# EAGLE design ScubaSteve (EAGLE 9.2.2)
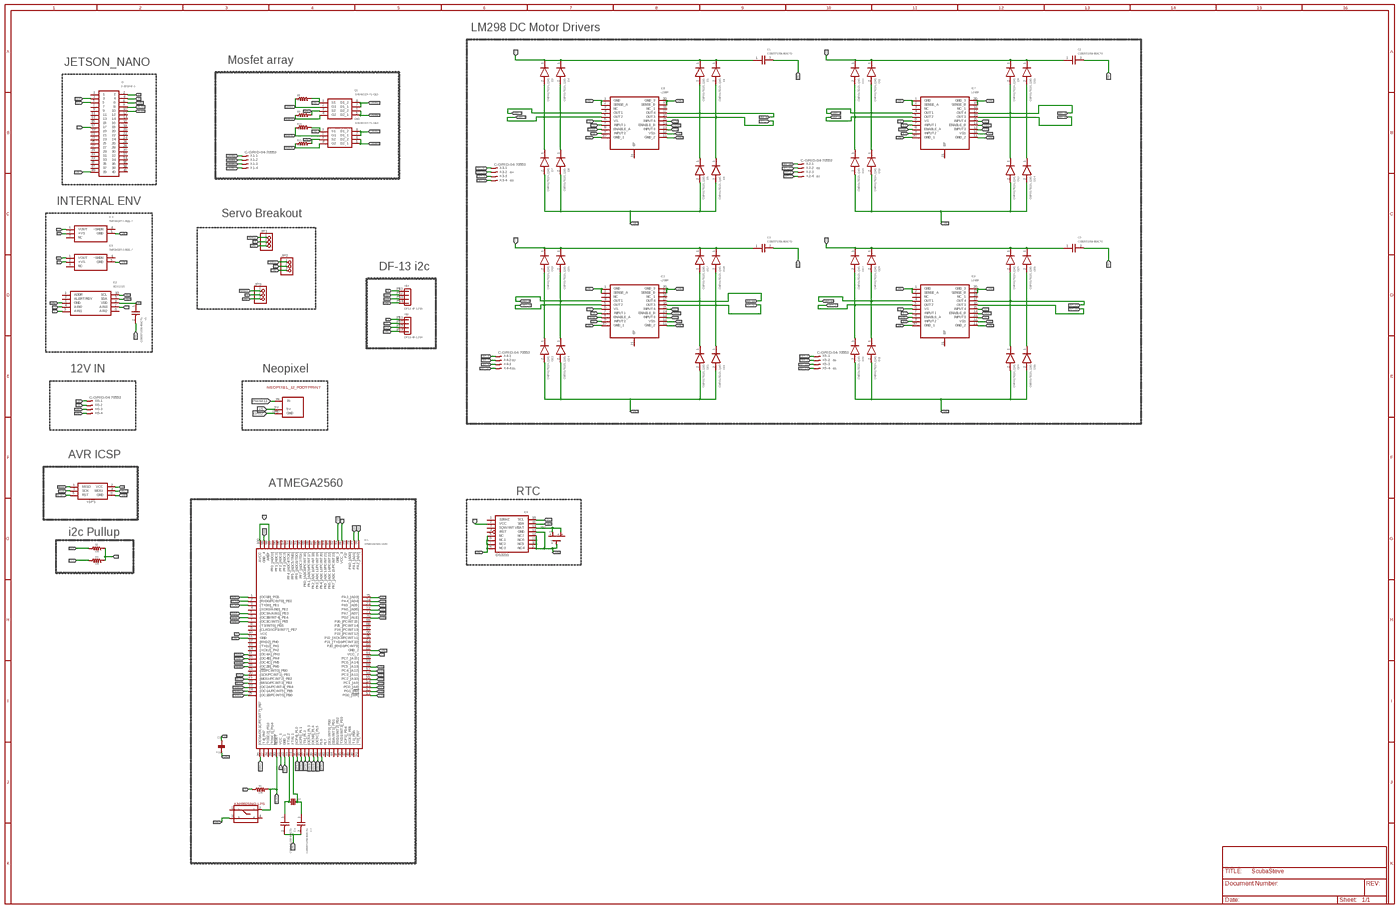
[diagram p0: schematic, sheet 1, overview]
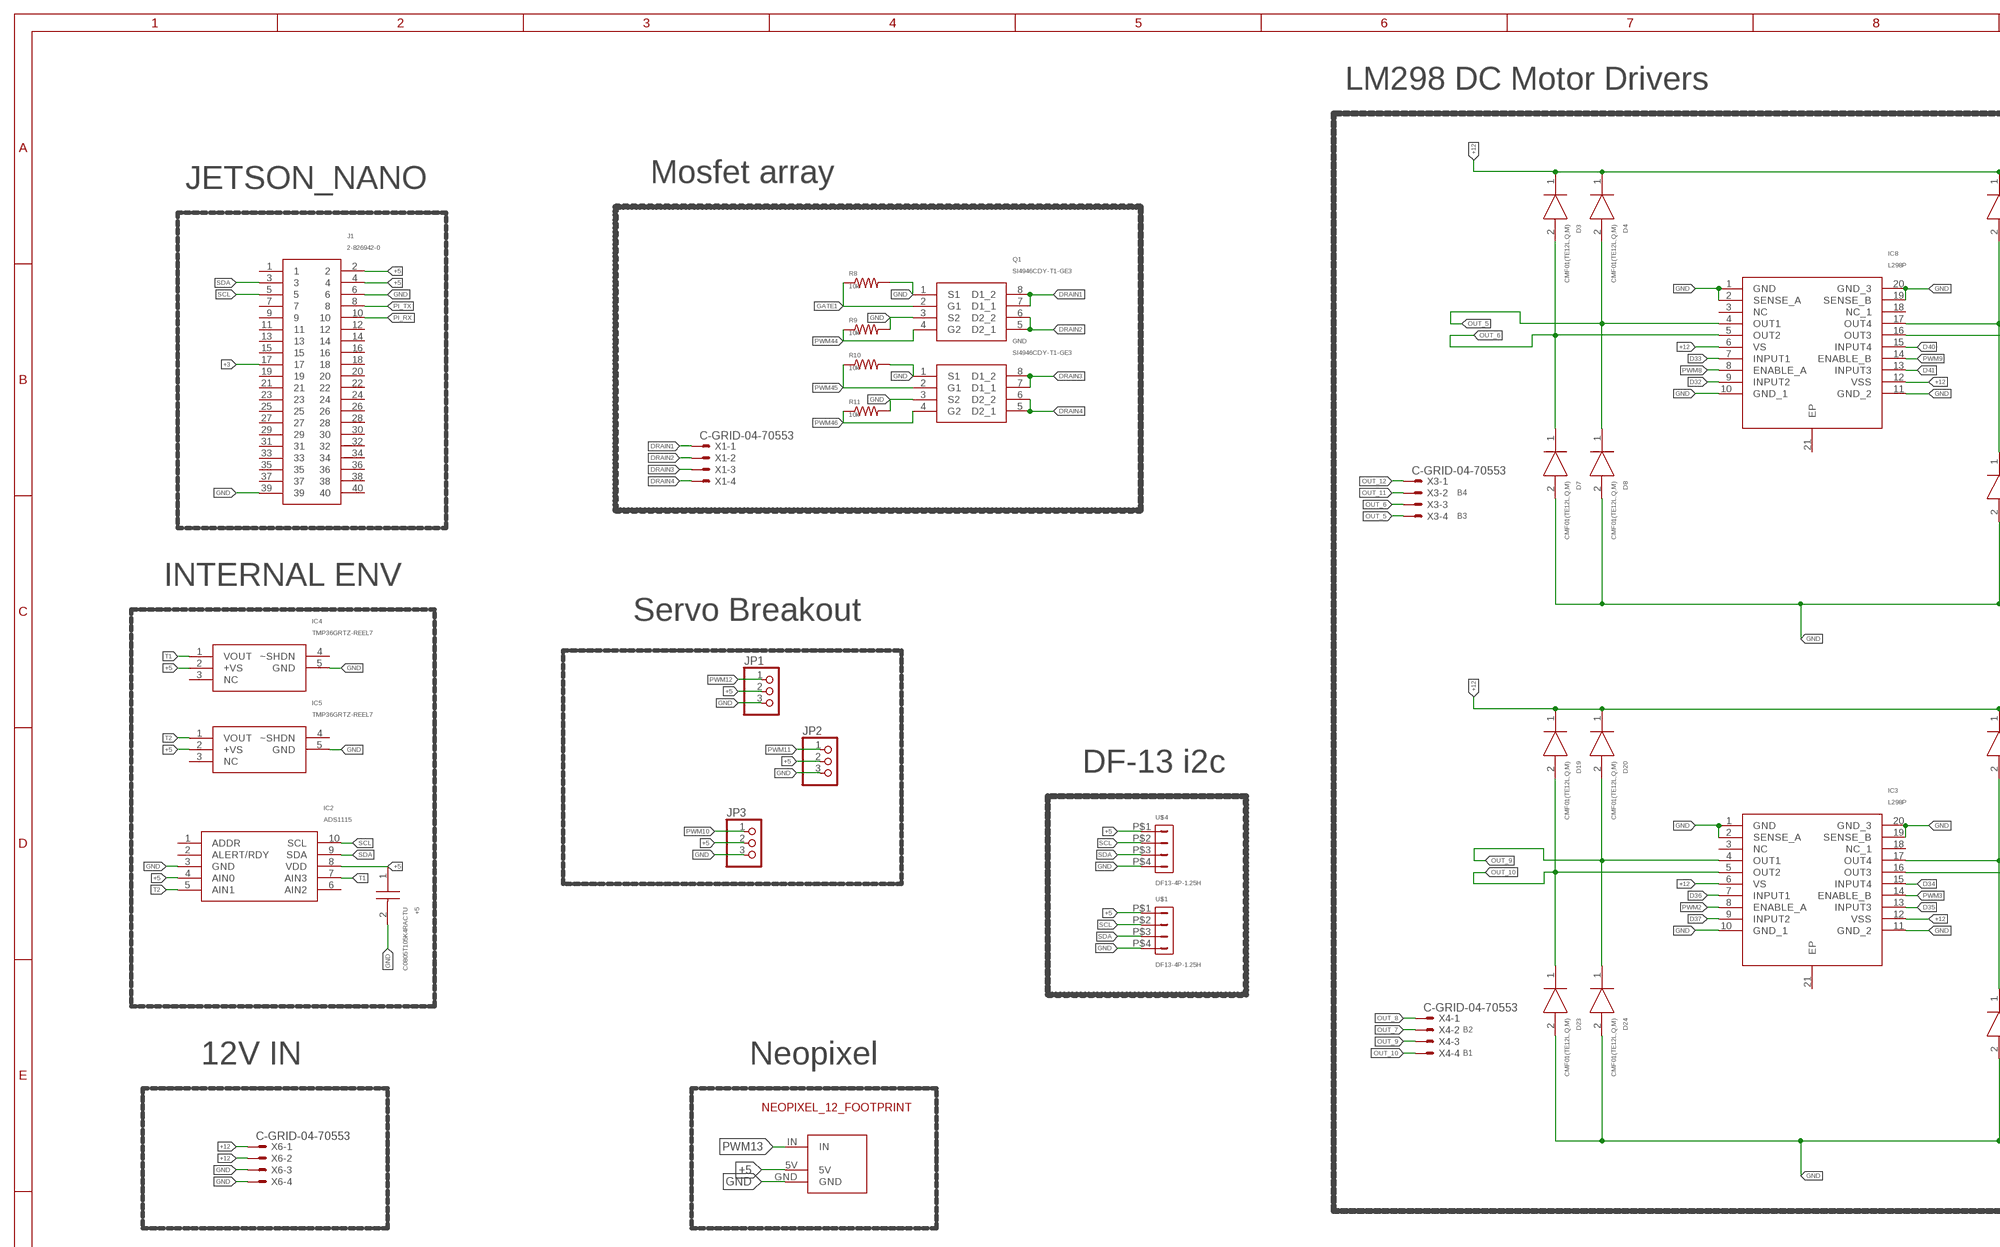
[diagram p1: schematic, sheet 1, part 1 of 4]
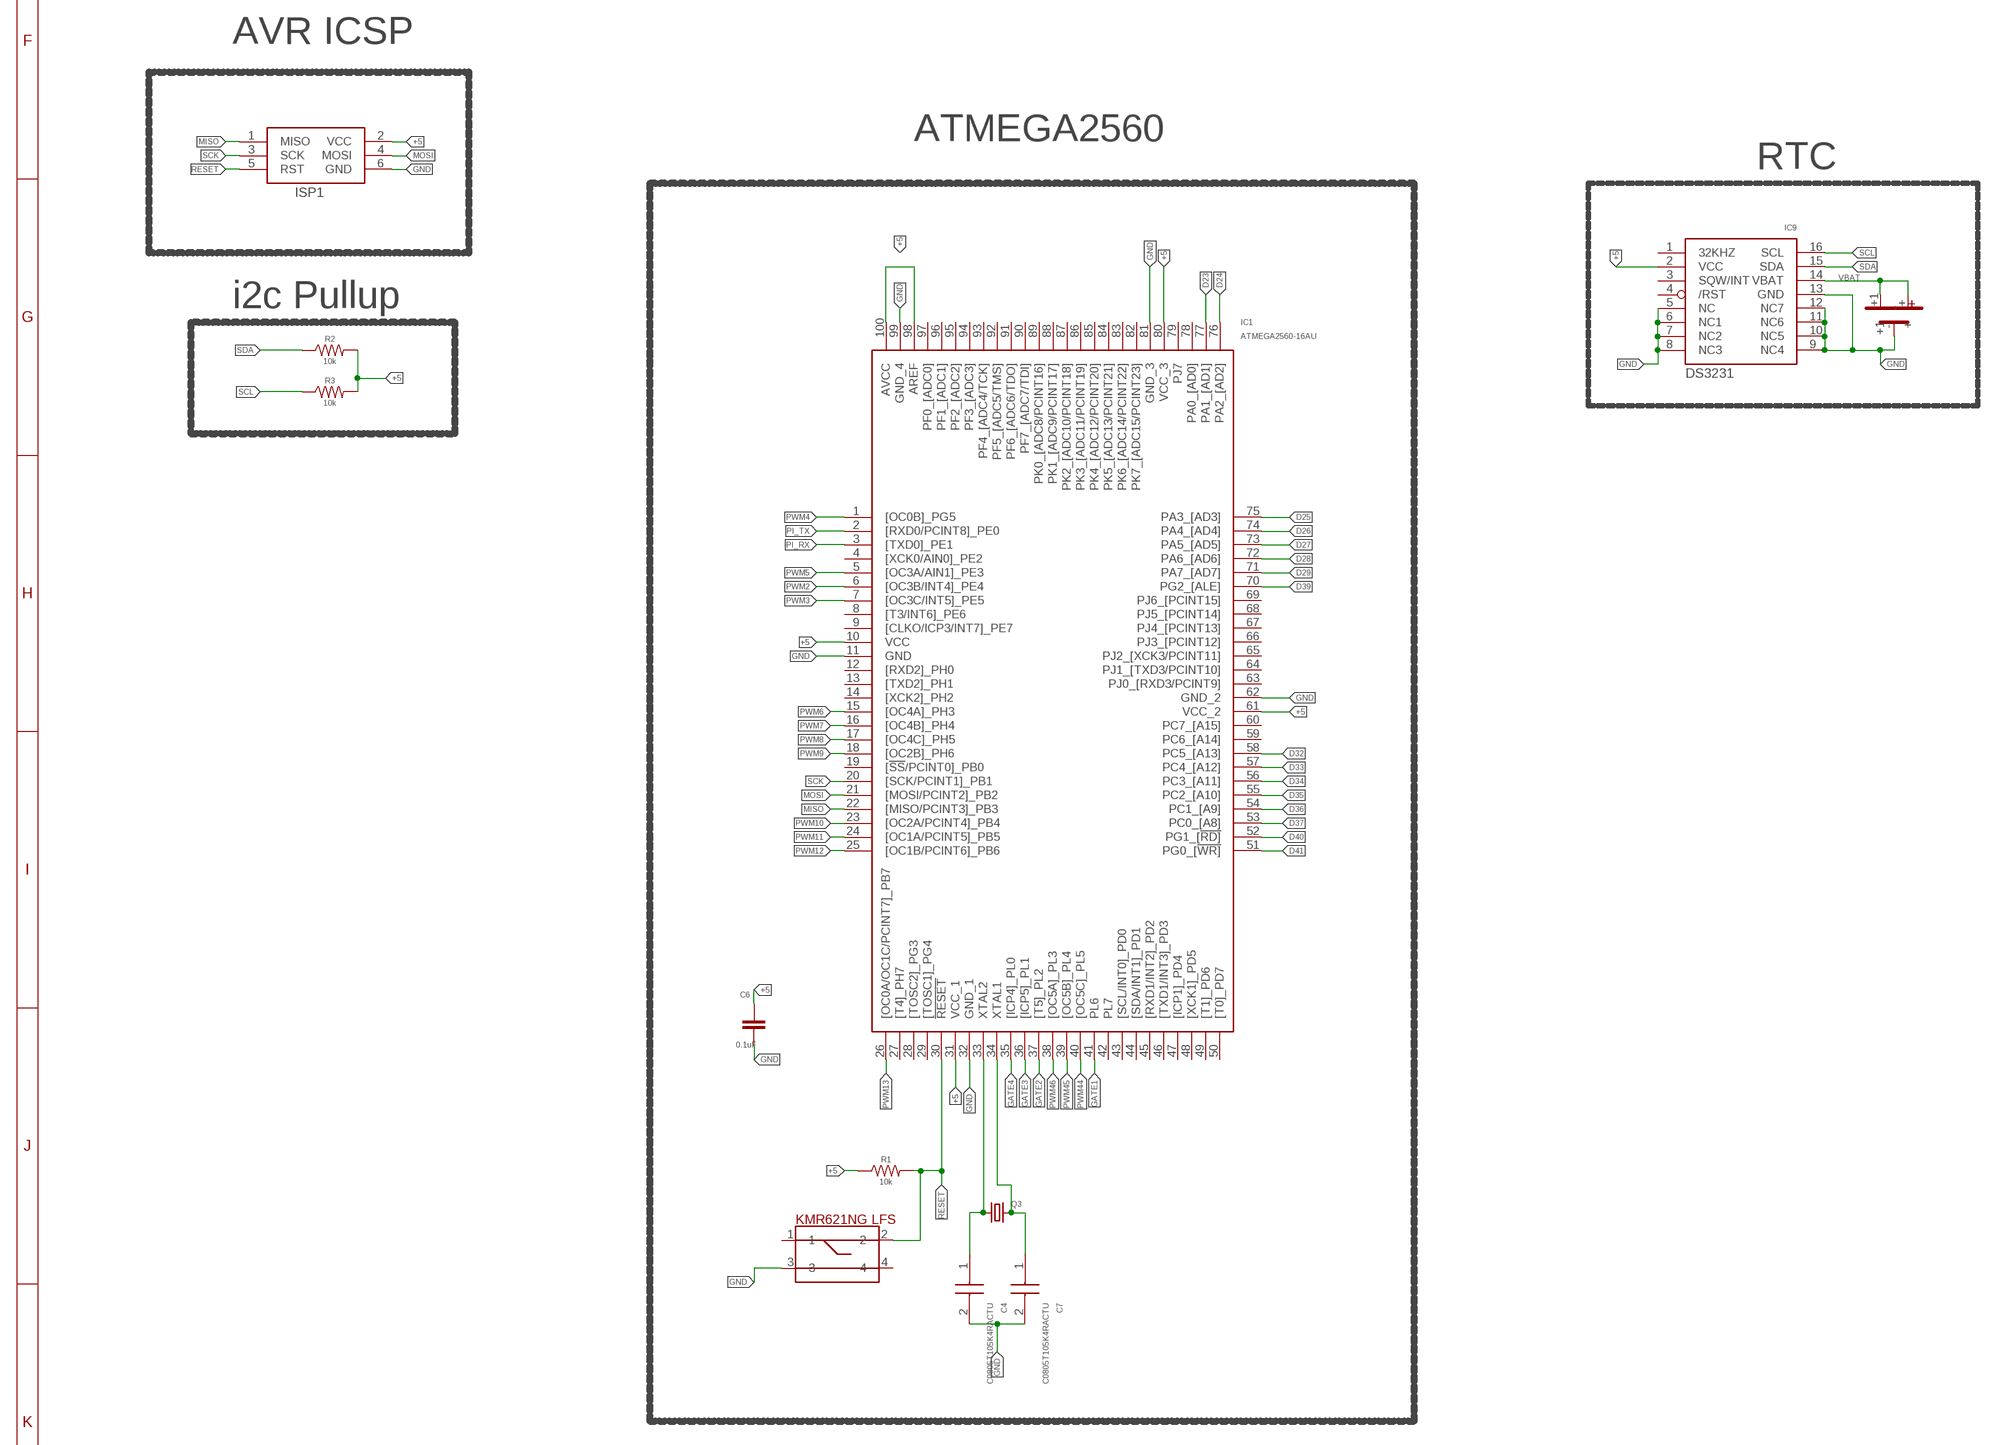
[diagram p2: schematic, sheet 1, part 2 of 4]
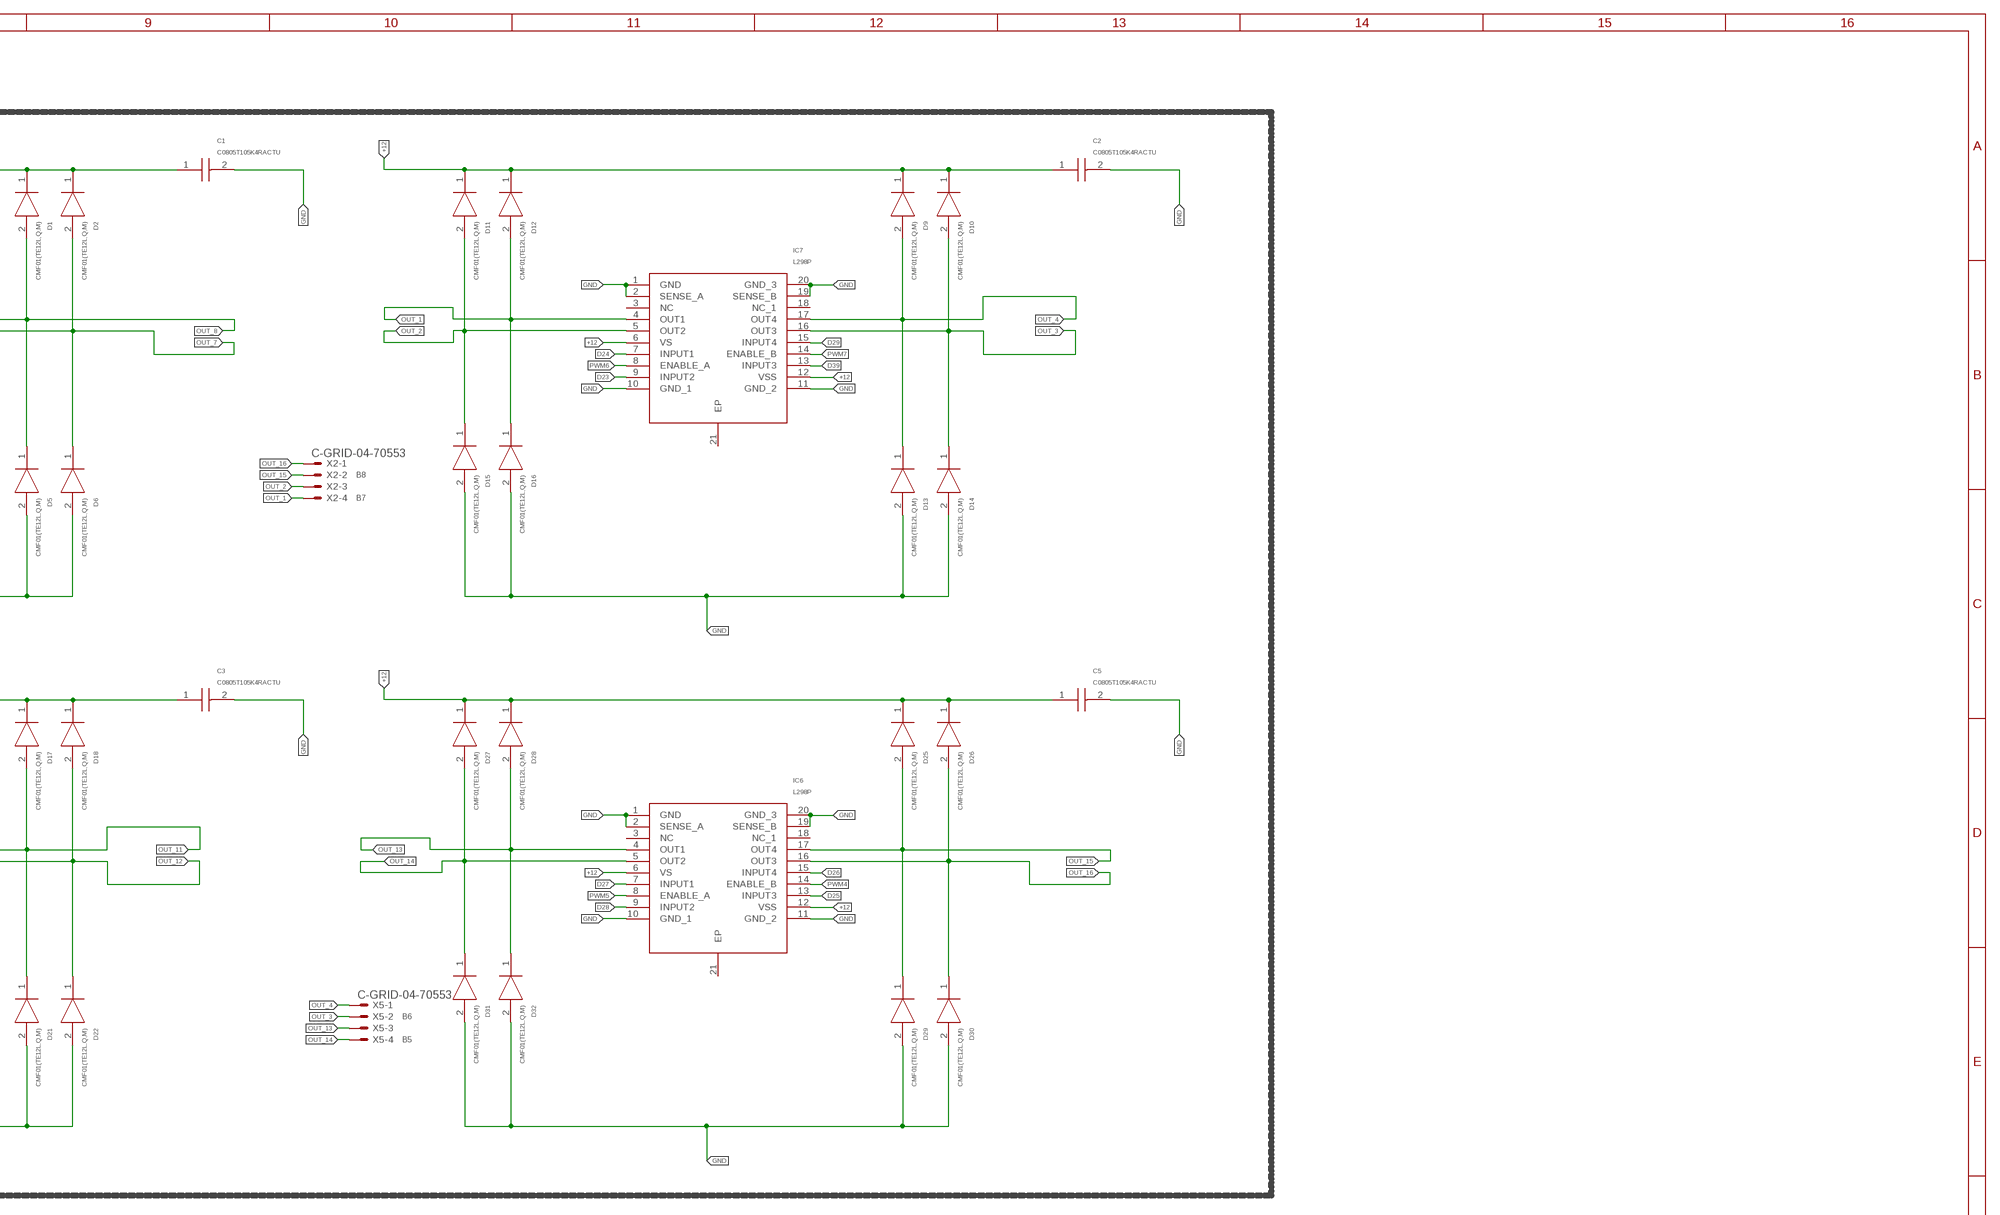
[diagram p3: schematic, sheet 1, part 3 of 4]
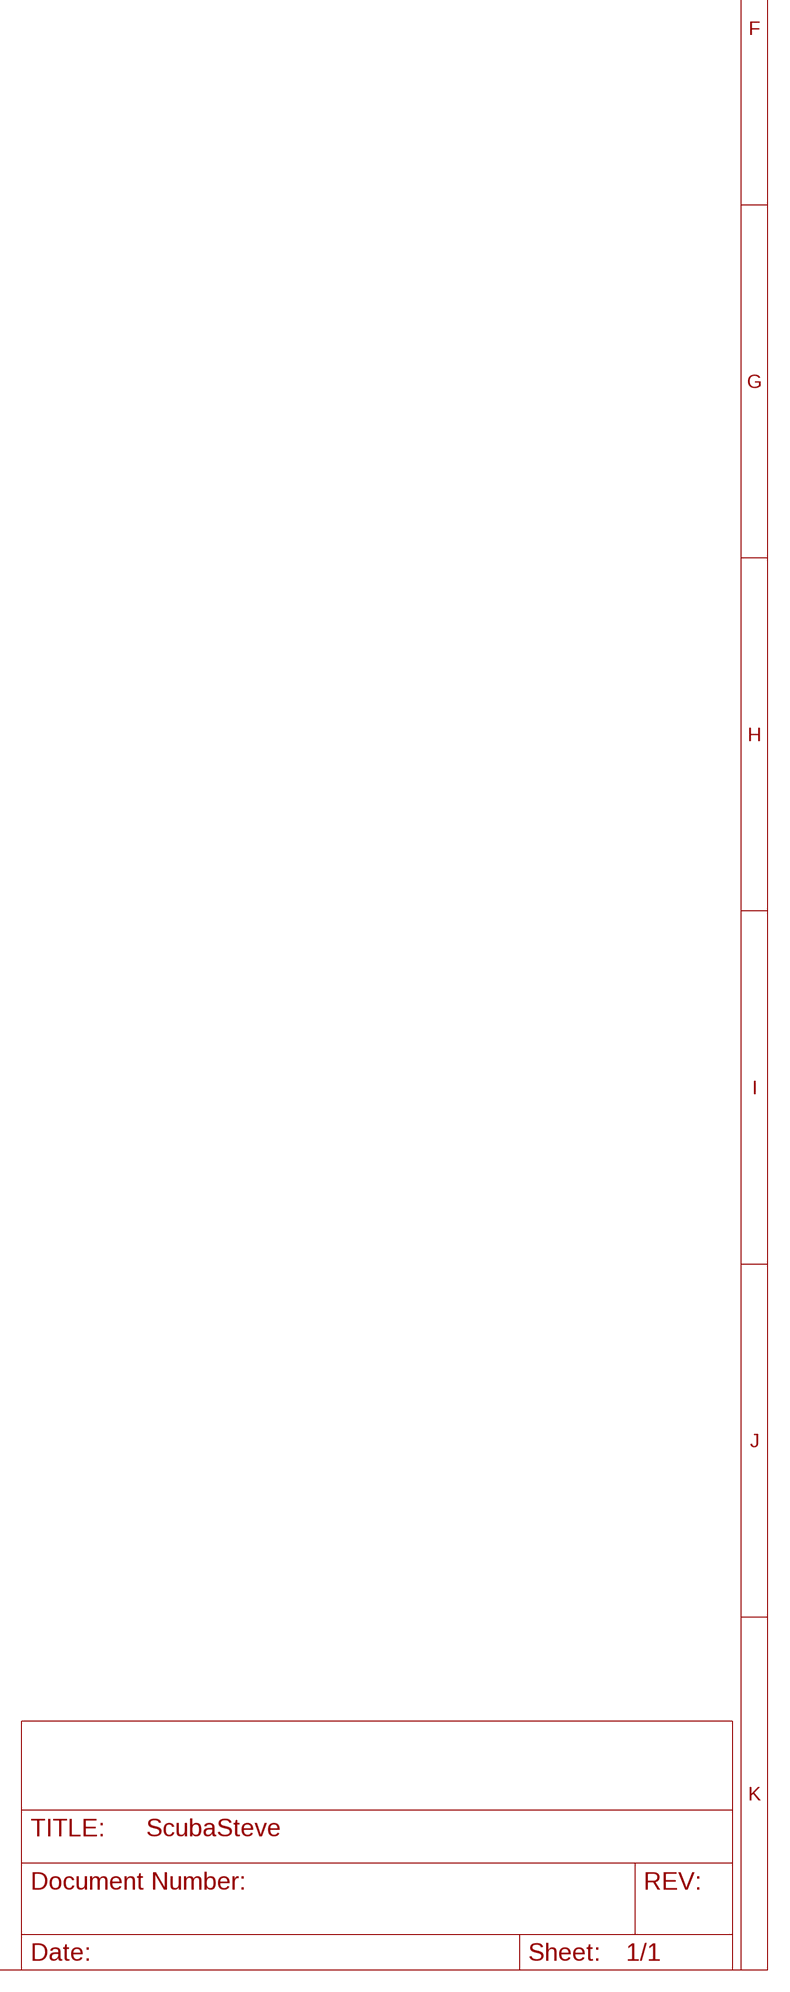
[diagram p4: schematic, sheet 1, part 4 of 4]

## Parts
+5  C0805T105K4RACTU  [CAPC2012X100N]
C1  C0805T105K4RACTU  [CAPC2012X100N]
C2  C0805T105K4RACTU  [CAPC2012X100N]
C3  C0805T105K4RACTU  [CAPC2012X100N]
C4  C0805T105K4RACTU  [CAPC2012X100N]
C5  C0805T105K4RACTU  [CAPC2012X100N]
C6  0.1uF  CC0805KRX7R9BB104  [CAP_0805]
C7  C0805T105K4RACTU  [CAPC2012X100N]
D1  CMF01(TE12L,Q,M)  [SODFL4724X108N]
D2  CMF01(TE12L,Q,M)  [SODFL4724X108N]
D3  CMF01(TE12L,Q,M)  [SODFL4724X108N]
D4  CMF01(TE12L,Q,M)  [SODFL4724X108N]
D5  CMF01(TE12L,Q,M)  [SODFL4724X108N]
D6  CMF01(TE12L,Q,M)  [SODFL4724X108N]
D7  CMF01(TE12L,Q,M)  [SODFL4724X108N]
D8  CMF01(TE12L,Q,M)  [SODFL4724X108N]
D9  CMF01(TE12L,Q,M)  [SODFL4724X108N]
D10  CMF01(TE12L,Q,M)  [SODFL4724X108N]
D11  CMF01(TE12L,Q,M)  [SODFL4724X108N]
D12  CMF01(TE12L,Q,M)  [SODFL4724X108N]
D13  CMF01(TE12L,Q,M)  [SODFL4724X108N]
D14  CMF01(TE12L,Q,M)  [SODFL4724X108N]
D15  CMF01(TE12L,Q,M)  [SODFL4724X108N]
D16  CMF01(TE12L,Q,M)  [SODFL4724X108N]
D17  CMF01(TE12L,Q,M)  [SODFL4724X108N]
D18  CMF01(TE12L,Q,M)  [SODFL4724X108N]
D19  CMF01(TE12L,Q,M)  [SODFL4724X108N]
D20  CMF01(TE12L,Q,M)  [SODFL4724X108N]
D21  CMF01(TE12L,Q,M)  [SODFL4724X108N]
D22  CMF01(TE12L,Q,M)  [SODFL4724X108N]
D23  CMF01(TE12L,Q,M)  [SODFL4724X108N]
D24  CMF01(TE12L,Q,M)  [SODFL4724X108N]
D25  CMF01(TE12L,Q,M)  [SODFL4724X108N]
D26  CMF01(TE12L,Q,M)  [SODFL4724X108N]
D27  CMF01(TE12L,Q,M)  [SODFL4724X108N]
D28  CMF01(TE12L,Q,M)  [SODFL4724X108N]
D29  CMF01(TE12L,Q,M)  [SODFL4724X108N]
D30  CMF01(TE12L,Q,M)  [SODFL4724X108N]
D31  CMF01(TE12L,Q,M)  [SODFL4724X108N]
D32  CMF01(TE12L,Q,M)  [SODFL4724X108N]
GND  SI4946CDY-T1-GE3  [SOIC127P600X175-8N]
IC1  ATMEGA2560-16AU  [QFP50P1600X1600X120-100N]
IC2  ADS1115  ADS1115IDGST  [SOP50P490X110-10N]
IC3  L298P  [SOIC127P1420X360-21N]
IC4  TMP36GRTZ-REEL7  [SOT95P280X145-5N]
IC5  TMP36GRTZ-REEL7  [SOT95P280X145-5N]
IC6  L298P  [SOIC127P1420X360-21N]
IC7  L298P  [SOIC127P1420X360-21N]
IC8  L298P  [SOIC127P1420X360-21N]
IC9  DS3231/SO  [SO16W]
ISP1  AVRISP-6  [AVRISP]
J1  2-826942-0  [HDRV40W63P254_2X20_5080X500X88]
JP1  PINHD-1X3  [1X03]
JP2  PINHD-1X3  [1X03]
JP3  PINHD-1X3  [1X03]
Q1  SI4946CDY-T1-GE3  [SOIC127P600X175-8N]
Q3  CRYSTALHC49S  [HC49/S]
R1  10k  10KOHM-0603-1/10W-1%  [0603]
R2  10k  10KOHM-0603-1/10W-1%  [0603]
R3  10k  10KOHM-0603-1/10W-1%  [0603]
R8  10k  10KOHM-0603-1/10W-1%  [0603]
R9  10k  10KOHM-0603-1/10W-1%  [0603]
R10  10k  10KOHM-0603-1/10W-1%  [0603]
R11  10k  10KOHM-0603-1/10W-1%  [0603]
U$1  DF13-4P-1.25H  [DF13A-4P-1.25H]
U$3  NEOPIXEL_12_FOOTPRINT  [NEOPIXEL_12_FOOTPRINT]
U$4  DF13-4P-1.25H  [DF13A-4P-1.25H]
U$11  CR1220_HOLDER  [CR1220_HOLDER]
U$12  KMR621NGLFS  [KMR621NGLFS]
X1  C-GRID-04-70553  [70553-04]
X2  C-GRID-04-70553  [70553-04]
X3  C-GRID-04-70553  [70553-04]
X4  C-GRID-04-70553  [70553-04]
X5  C-GRID-04-70553  [70553-04]
X6  C-GRID-04-70553  [70553-04]

## Nets
+3: J1.17
+5: +5.1 C6.1 IC1.10(VCC) IC1.31(VCC_1) IC1.61(VCC_2) IC1.80(VCC_3) IC1.98(AREF) IC1.100(AVCC) IC2.4(AIN0) IC2.8(VDD) IC4.2(+VS) IC5.2(+VS) IC9.2(VCC) ISP1.2(VCC) J1.2 J1.4 JP1.2 JP2.2 JP3.2 R1.1 R2.2 R3.2 U$1.P$1 U$3.5V U$4.P$1
+12: C1.1 C2.1 C3.1 C5.1 D1.1(K) D2.1(K) D3.1(K) D4.1(K) D9.1(K) D10.1(K) D11.1(K) D12.1(K) D17.1(K) D18.1(K) D19.1(K) D20.1(K) D25.1(K) D26.1(K) D27.1(K) D28.1(K) IC3.6(VS) IC3.12(VSS) IC6.6(VS) IC6.12(VSS) IC7.6(VS) IC7.12(VSS) IC8.6(VS) IC8.12(VSS) X6.1 X6.2
D23: IC1.77(PA1_[AD1]) IC7.9(INPUT2)
D24: IC1.76(PA2_[AD2]) IC7.7(INPUT1)
D25: IC1.75(PA3_[AD3]) IC6.13(INPUT3)
D26: IC1.74(PA4_[AD4]) IC6.15(INPUT4)
D27: IC1.73(PA5_[AD5]) IC6.7(INPUT1)
D28: IC1.72(PA6_[AD6]) IC6.9(INPUT2)
D29: IC1.71(PA7_[AD7]) IC7.15(INPUT4)
D32: IC1.58(PC5_[A13]) IC8.9(INPUT2)
D33: IC1.57(PC4_[A12]) IC8.7(INPUT1)
D34: IC1.56(PC3_[A11]) IC3.15(INPUT4)
D35: IC1.55(PC2_[A10]) IC3.13(INPUT3)
D36: IC1.54(PC1_[A9]) IC3.7(INPUT1)
D37: IC1.53(PC0_[A8]) IC3.9(INPUT2)
D39: IC1.70(PG2_[ALE]) IC7.13(INPUT3)
D40: IC1.52(PG1_[!RD]) IC8.15(INPUT4)
D41: IC1.51(PG0_[!WR]) IC8.13(INPUT3)
DRAIN1: Q1.7(D1_1) Q1.8(D1_2) X1.1
DRAIN2: Q1.5(D2_1) Q1.6(D2_2) X1.2
DRAIN3: GND.7(D1_1) GND.8(D1_2) X1.3
DRAIN4: GND.5(D2_1) GND.6(D2_2) X1.4
GATE1: IC1.41(PL6) Q1.2(G1) R8.1
GATE2: IC1.37([T5]_PL2)
GATE3: IC1.36([ICP5]_PL1)
GATE4: IC1.35([ICP4]_PL0)
GND: +5.2 C1.2 C2.2 C3.2 C4.2 C5.2 C6.2 C7.2 D5.2(A) D6.2(A) D7.2(A) D8.2(A) D13.2(A) D14.2(A) D15.2(A) D16.2(A) D21.2(A) D22.2(A) D23.2(A) D24.2(A) D29.2(A) D30.2(A) D31.2(A) D32.2(A) GND.1(S1) GND.3(S2) IC1.11(GND) IC1.32(GND_1) IC1.62(GND_2) IC1.81(GND_3) IC1.99(GND_4) IC2.3(GND) IC3.1(GND) IC3.2(SENSE_A) IC3.10(GND_1) IC3.11(GND_2) IC3.19(SENSE_B) IC3.20(GND_3) IC4.5(GND) IC5.5(GND) IC6.1(GND) IC6.2(SENSE_A) IC6.10(GND_1) IC6.11(GND_2) IC6.19(SENSE_B) IC6.20(GND_3) IC7.1(GND) IC7.2(SENSE_A) IC7.10(GND_1) IC7.11(GND_2) IC7.19(SENSE_B) IC7.20(GND_3) IC8.1(GND) IC8.2(SENSE_A) IC8.10(GND_1) IC8.11(GND_2) IC8.19(SENSE_B) IC8.20(GND_3) IC9.5(NC) IC9.6(NC1) IC9.7(NC2) IC9.8(NC3) IC9.9(NC4) IC9.10(NC5) IC9.11(NC6) IC9.12(NC7) IC9.13(GND) ISP1.6(GND) J1.6 J1.39 JP1.3 JP2.3 JP3.3 Q1.1(S1) Q1.3(S2) R8.2 R9.2 R10.2 R11.2 U$1.P$4 U$3.GND U$4.P$4 U$11.- U$12.3 X6.3 X6.4
MISO: IC1.22([MISO/PCINT3]_PB3) ISP1.1(MISO)
MOSI: IC1.21([MOSI/PCINT2]_PB2) ISP1.4(MOSI)
N$1: C4.1 IC1.33(XTAL2) Q3.1
N$2: C7.1 IC1.34(XTAL1) Q3.2
OUT_1: D12.2(A) D16.1(K) IC7.4(OUT1) X2.4
OUT_2: D11.2(A) D15.1(K) IC7.5(OUT2) X2.3
OUT_3: D10.2(A) D14.1(K) IC7.16(OUT3) X5.2
OUT_4: D9.2(A) D13.1(K) IC7.17(OUT4) X5.1
OUT_5: D4.2(A) D8.1(K) IC8.4(OUT1) X3.4
OUT_6: D3.2(A) D7.1(K) IC8.5(OUT2) X3.3
OUT_7: D2.2(A) D6.1(K) IC8.16(OUT3) X4.2
OUT_8: D1.2(A) D5.1(K) IC8.17(OUT4) X4.1
OUT_9: D20.2(A) D24.1(K) IC3.4(OUT1) X4.3
OUT_10: D19.2(A) D23.1(K) IC3.5(OUT2) X4.4
OUT_11: D17.2(A) D21.1(K) IC3.17(OUT4) X3.2
OUT_12: D18.2(A) D22.1(K) IC3.16(OUT3) X3.1
OUT_13: D28.2(A) D32.1(K) IC6.4(OUT1) X5.3
OUT_14: D27.2(A) D31.1(K) IC6.5(OUT2) X5.4
OUT_15: D25.2(A) D29.1(K) IC6.17(OUT4) X2.2
OUT_16: D26.2(A) D30.1(K) IC6.16(OUT3) X2.1
PI_RX: IC1.3([TXD0]_PE1) J1.10
PI_TX: IC1.2([RXD0/PCINT8]_PE0) J1.8
PWM2: IC1.6([OC3B/INT4]_PE4) IC3.8(ENABLE_A)
PWM3: IC1.7([OC3C/INT5]_PE5) IC3.14(ENABLE_B)
PWM4: IC1.1([OC0B]_PG5) IC6.14(ENABLE_B)
PWM5: IC1.5([OC3A/AIN1]_PE3) IC6.8(ENABLE_A)
PWM6: IC1.15([OC4A]_PH3) IC7.8(ENABLE_A)
PWM7: IC1.16([OC4B]_PH4) IC7.14(ENABLE_B)
PWM8: IC1.17([OC4C]_PH5) IC8.8(ENABLE_A)
PWM9: IC1.18([OC2B]_PH6) IC8.14(ENABLE_B)
PWM10: IC1.23([OC2A/PCINT4]_PB4) JP3.1
PWM11: IC1.24([OC1A/PCINT5]_PB5) JP2.1
PWM12: IC1.25([OC1B/PCINT6]_PB6) JP1.1
PWM13: IC1.26([OC0A/OC1C/PCINT7]_PB7) U$3.IN
PWM44: IC1.40([OC5C]_PL5) Q1.4(G2) R9.1
PWM45: GND.2(G1) IC1.39([OC5B]_PL4) R10.1
PWM46: GND.4(G2) IC1.38([OC5A]_PL3) R11.1
RESET: IC1.30(!RESET) ISP1.5(RST) R1.2 U$12.2
SCK: IC1.20([SCK/PCINT1]_PB1) ISP1.3(SCK)
SCL: IC2.10(SCL) IC9.16(SCL) J1.5 R3.1 U$1.P$2 U$4.P$2
SDA: IC2.9(SDA) IC9.15(SDA) J1.3 R2.1 U$1.P$3 U$4.P$3
T1: IC2.7(AIN3) IC4.1(VOUT)
T2: IC2.5(AIN1) IC5.1(VOUT)
VBAT: IC9.14(VBAT) U$11.+ U$11.+1
Unconnected: IC1.4([XCK0/AIN0]_PE2) IC1.8([T3/INT6]_PE6) IC1.9([CLKO/ICP3/INT7]_PE7) IC1.12([RXD2]_PH0) IC1.13([TXD2]_PH1) IC1.14([XCK2]_PH2) IC1.19([!SS!/PCINT0]_PB0) IC1.27([T4]_PH7) IC1.28([TOSC2]_PG3) IC1.29([TOSC1]_PG4) IC1.42(PL7) IC1.43([SCL/INT0]_PD0) IC1.44([SDA/INT1]_PD1) IC1.45([RXD1/INT2]_PD2) IC1.46([TXD1/INT3]_PD3) IC1.47([ICP1]_PD4) IC1.48([XCK1]_PD5) IC1.49([T1]_PD6) IC1.50([T0]_PD7) IC1.59(PC6_[A14]) IC1.60(PC7_[A15]) IC1.63(PJ0_[RXD3/PCINT9]) IC1.64(PJ1_[TXD3/PCINT10]) IC1.65(PJ2_[XCK3/PCINT11]) IC1.66(PJ3_[PCINT12]) IC1.67(PJ4_[PCINT13]) IC1.68(PJ5_[PCINT14]) IC1.69(PJ6_[PCINT15]) IC1.78(PA0_[AD0]) IC1.79(PJ7) IC1.82(PK7_[ADC15/PCINT23]) IC1.83(PK6_[ADC14/PCINT22]) IC1.84(PK5_[ADC13/PCINT21]) IC1.85(PK4_[ADC12/PCINT20]) IC1.86(PK3_[ADC11/PCINT19]) IC1.87(PK2_[ADC10/PCINT18]) IC1.88(PK1_[ADC9/PCINT17]) IC1.89(PK0_[ADC8/PCINT16]) IC1.90(PF7_[ADC7/TDI]) IC1.91(PF6_[ADC6/TDO]) IC1.92(PF5_[ADC5/TMS]) IC1.93(PF4_[ADC4/TCK]) IC1.94(PF3_[ADC3]) IC1.95(PF2_[ADC2]) IC1.96(PF1_[ADC1]) IC1.97(PF0_[ADC0]) IC2.1(ADDR) IC2.2(ALERT/RDY) IC2.6(AIN2) IC3.3(NC) IC3.18(NC_1) IC3.21(EP) IC4.3(NC) IC4.4(~SHDN) IC5.3(NC) IC5.4(~SHDN) IC6.3(NC) IC6.18(NC_1) IC6.21(EP) IC7.3(NC) IC7.18(NC_1) IC7.21(EP) IC8.3(NC) IC8.18(NC_1) IC8.21(EP) IC9.1(32KHZ) IC9.3(SQW/INT) IC9.4(/RST) J1.1 J1.7 J1.9 J1.11 J1.12 J1.13 J1.14 J1.15 J1.16 J1.18 J1.19 J1.20 J1.21 J1.22 J1.23 J1.24 J1.25 J1.26 J1.27 J1.28 J1.29 J1.30 J1.31 J1.32 J1.33 J1.34 J1.35 J1.36 J1.37 J1.38 J1.40 U$12.1 U$12.4

## Notes on the sheet
- LM298 DC Motor Drivers
- JETSON_NANO | Mosfet array
- B8
- B4
- B7
- B3
- INTERNAL ENV
- Servo Breakout
- DF-13 i2c
- B2 | B6
- B1 | B5
- 12V IN | Neopixel
- AVR ICSP
- ATMEGA2560
- RTC
- i2c Pullup

## Library data of the parts
+5 C1-C5 C7 = SamacSys_Parts:C0805T105K4RACTU: KEMET - C0805T105K4RACTU - CAP, 1F, 16V, 10%, X7R, 0805 Source: Datasheet <https://componentsearchengine.com/Datasheets/1/C0805T105K4RACTU.pdf>; DESCRIPTION: KEMET - C0805T105K4RACTU - CAP, 1F, 16V, 10%, X7R, 0805; HEIGHT: 1mm; MANUFACTURER_NAME: Kemet; MANUFACTURER_PART_NUMBER: C0805T105K4RACTU; MOUSER_PART_NUMBER: 80-C0805T105K4RACTU
C6 = Resistor_Capacitor:CC0805KRX7R9BB104: CAP CER 0.1UF 50V X7R 0805 Manufacturer's datasheet <http://www.yageo.com/documents/recent/UPY-GPHC_X7R_6.3V-to-50V_18.pdf>; CREATED_BY: PCBLayout.com; DIGIKEY_PART_NUMBER: 311-1140-2-ND; MANUFACTURER: Yageo; MPN: CC0805KRX7R9BB104; PACKAGE: SMD 0805
D1-D32 = SamacSys_Parts:CMF01(TE12L,Q,M): Diodes - General Purpose, Power, Switching 600V 2A M-FLAT Source: Datasheet <https://componentsearchengine.com/Datasheets/1/CMF01(TE12L,Q,M).pdf>; DESCRIPTION: Diodes - General Purpose, Power, Switching 600V 2A M-FLAT; HEIGHT: 1.08mm; MANUFACTURER_NAME: Toshiba; MANUFACTURER_PART_NUMBER: CMF01(TE12L,Q,M); MOUSER_PART_NUMBER: 757-CMF01TE12LQM
GND Q1 = SamacSys_Parts:SI4946CDY-T1-GE3: VISHAY - SI4946CDY-T1-GE3 - MOSFET, DUAL N-CH, 60V, SOIC Source: Datasheet <https://componentsearchengine.com/Datasheets/1/SI4946CDY-T1-GE3.pdf>; DESCRIPTION: VISHAY - SI4946CDY-T1-GE3 - MOSFET, DUAL N-CH, 60V, SOIC; HEIGHT: 1.75mm; MANUFACTURER_NAME: Vishay; MANUFACTURER_PART_NUMBER: SI4946CDY-T1-GE3; MOUSER_PART_NUMBER: 78-SI4946CDY-T1-GE3
IC1 = SamacSys_Parts:ATMEGA2560-16AU: ATMEGA2560-16AU, 8 bit AVR Microcontroller 16MHz 4, 256kb Flash, 8kb RAM, I2C SPI 100-Pin TQFP Source: Datasheet <https://componentsearchengine.com/Datasheets/1/ATMEGA2560-16AU.pdf>; DESCRIPTION: ATMEGA2560-16AU, 8 bit AVR Microcontroller 16MHz 4, 256kb Flash, 8kb RAM, I2C SPI 100-Pin TQFP; HEIGHT: 1.2mm; MANUFACTURER_NAME: Microchip; MANUFACTURER_PART_NUMBER: ATMEGA2560-16AU; MOUSER_PART_NUMBER: 556-ATMEGA2560-16AU
IC2 = SamacSys_Parts:ADS1115IDGST: 16-Bit, 860SPS, 4-Ch Delta-Sigma ADC w/ PGA, Oscillator, Voltage Reference, Comparator & I2C Source: Datasheet; DESCRIPTION: 16-Bit, 860SPS, 4-Ch Delta-Sigma ADC w/ PGA, Oscillator, Voltage Reference, Comparator & I2C; HEIGHT: 1.1mm; MANUFACTURER_NAME: Texas Instruments; MANUFACTURER_PART_NUMBER: ADS1115IDGST; MOUSER_PART_NUMBER: 595-ADS1115IDGST
IC3 IC6-IC8 = SamacSys_Parts:L298P: L298P, Full Bridge Motor Driver, 3A Dual Full Bridge Motor Driver,, 25W 4.8 46 V, 20-Pin Power SO Source: Datasheet <http://www.mouser.com/datasheet/2/389/l298-954744.pdf>; DESCRIPTION: L298P, Full Bridge Motor Driver, 3A Dual Full Bridge Motor Driver,, 25W 4.8 46 V, 20-Pin Power SO; HEIGHT: 3.6mm; MANUFACTURER_NAME: STMicroelectronics; MANUFACTURER_PART_NUMBER: L298P; MOUSER_PART_NUMBER: 511-L298P
IC4 IC5 = SamacSys_Parts:TMP36GRTZ-REEL7: Analog Devices TMP36GRTZ-REEL7 Temperature Sensor 5-Pin SOT-23, -40 +125 C Source: Datasheet <https://componentsearchengine.com/Datasheets/1/TMP36GRTZ-REEL7.pdf>; DESCRIPTION: Analog Devices TMP36GRTZ-REEL7 Temperature Sensor 5-Pin SOT-23, -40 +125 C; HEIGHT: mm; MANUFACTURER_NAME: Analog Devices; MANUFACTURER_PART_NUMBER: TMP36GRTZ-REEL7; MOUSER_PART_NUMBER: 584-TMP36GRTZ-R7
IC9 = adafruit:DS3231
ISP1 = adafruit:AVRISP: AVR ISP HEADER Standard 6 pin header for AVR programming
J1 = SamacSys_Parts:2-826942-0: 2x20 straight pin header tin Mod II Source: Datasheet <https://componentsearchengine.com/Datasheets/1/2-826942-0.pdf>; DESCRIPTION: 2x20 straight pin header tin Mod II; HEIGHT: 8.8mm; MANUFACTURER_NAME: TE Connectivity; MANUFACTURER_PART_NUMBER: 2-826942-0; MOUSER_PART_NUMBER: 571-2-826942-0
JP1-JP3 = adafruit:PINHD-1X3: PIN HEADER
Q3 = adafruit:CRYSTAL: CRYSTAL; OC_FARNELL: 1667008; OC_NEWARK: unknown
R1-R3 R8-R11 = SparkFun-Resistors:10KOHM: 10kΩ resistor A resistor is a passive two-terminal electrical component that implements electrical resistance as a circuit element. Resistors act to reduce current flow, and, at the same time, act to lower voltage levels within circuits. - Wikipedia; PROD_ID: RES-00824
U$1 U$4 = con-hirose-df13:DF13-4P-1.25: DF13-4P 1.25mm Pitch Miniature Crimping Connector.
U$3 = NEOPIXEL_12_FOOTPRINT:NEOPIXEL_12_FOOTPRINT
U$11 = CR1220_HOLDER:CR1220_HOLDER
U$12 = KMR621NG LFS:KMR621NGLFS
X1-X6 = con-molex:C-GRID-04: CONNECTOR wire to board 2.54 mm (0.100") pitch header; MF: MOLEX; OC_FARNELL: unknown; OC_NEWARK: unknown

## Board
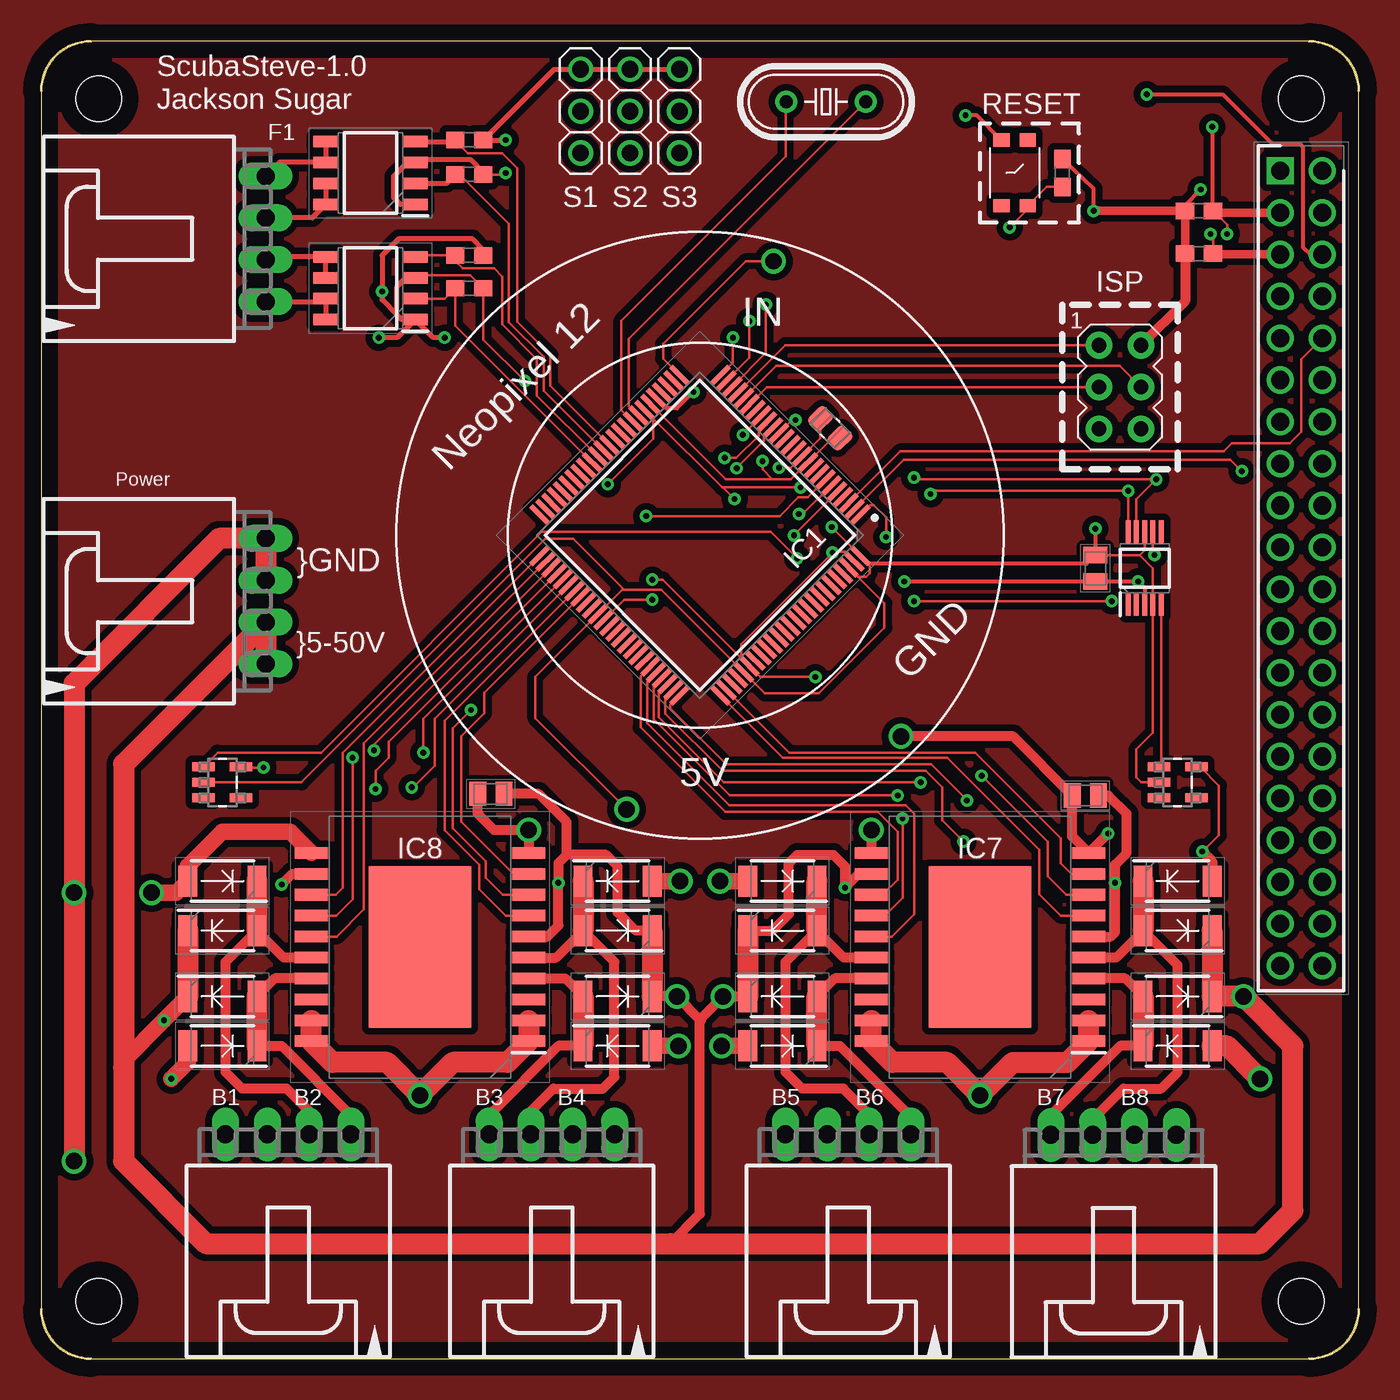
[diagram p5: board, top side]
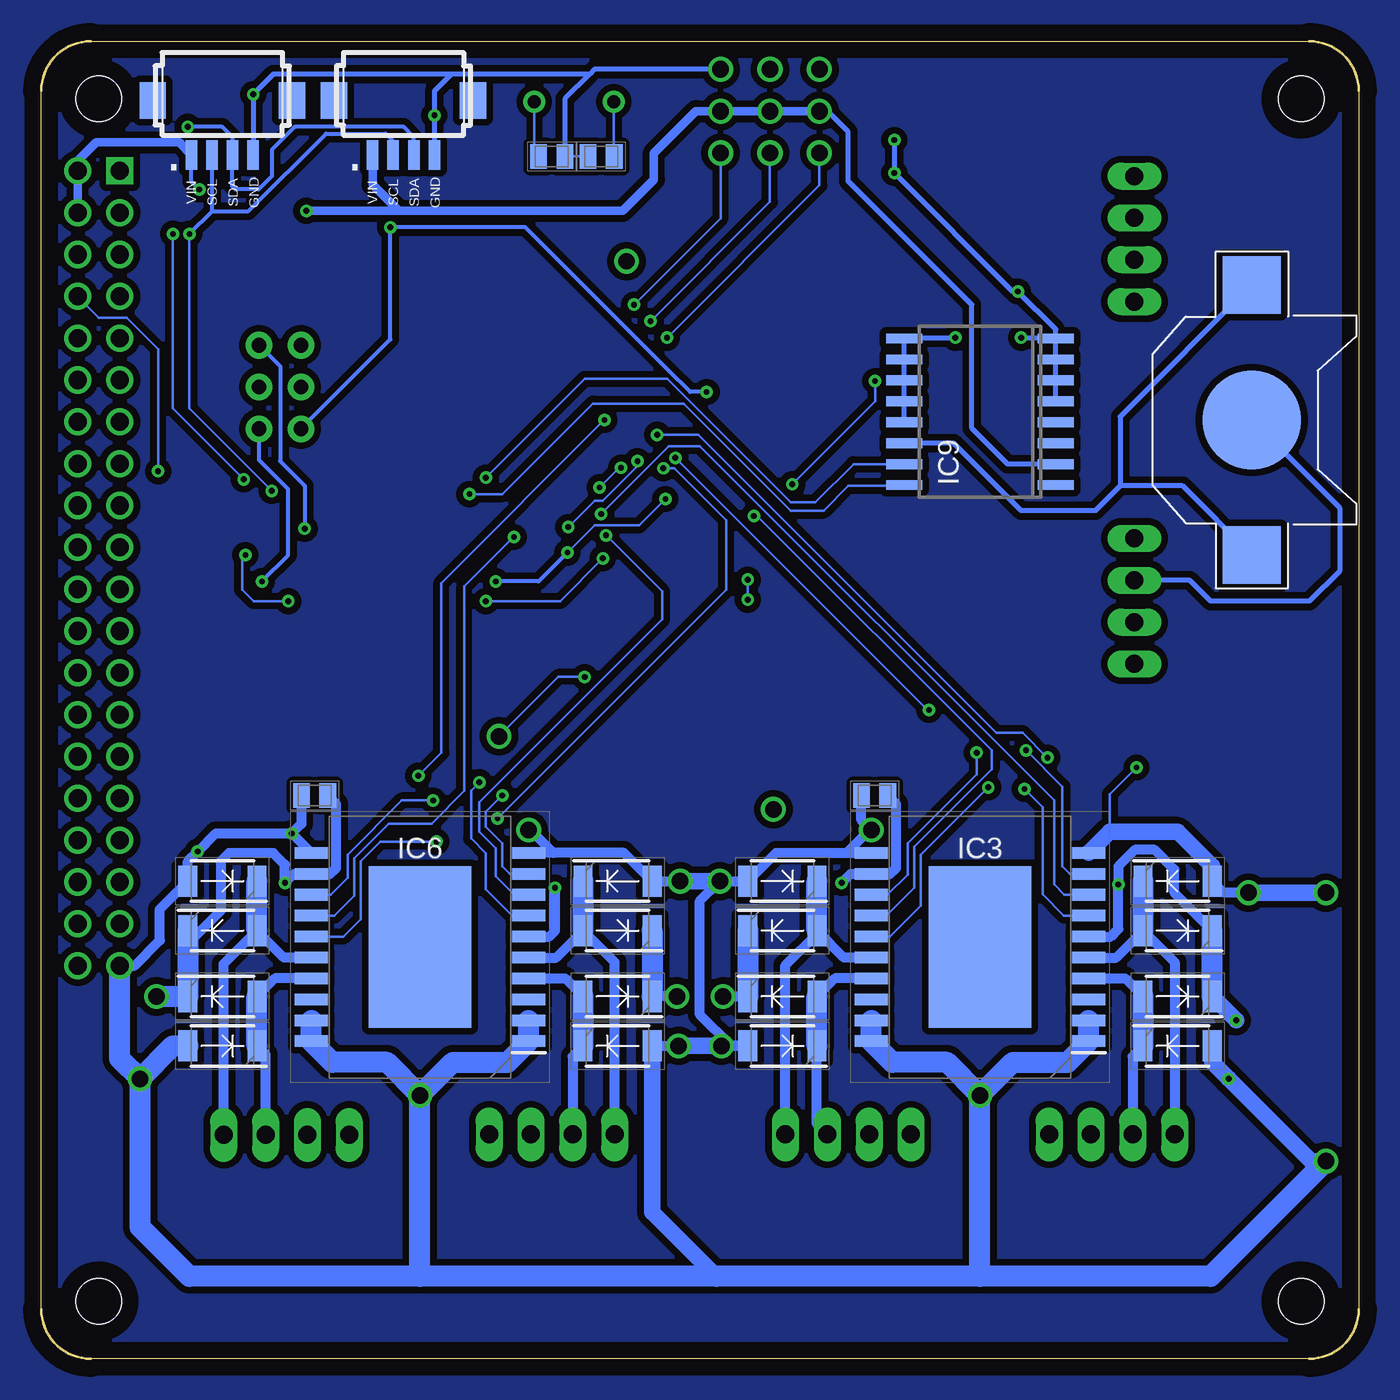
[diagram p6: board, bottom side, seen from below]

Size 80 x 80 mm. Coordinates in mm from the lower left corner, seen from the top.
Outline: 3,0 77,0 arc90 80,3 80,77 arc90 77,80 3,80 arc90 0,77 0,3 arc90 3,0
Copper layers (1*16): Top 0.035mm / dielectric 1.5mm / Bottom 0.035mm
Design rules "default": minimum track width 6mil, minimum drill 0.35mm, track to track 6mil, track to pad 6mil, pad to pad 6mil, via to via 6mil, smd to smd 6mil, copper to edge 40mil, drill to drill 6mil, minimum pad ring 10mil, minimum via ring 8mil, stop-mask expansion 4mil, vias tented up to drill 0mil, thermal gap 10mil
Holes 2.75 mm at 3.5,3.5 76.5,3.5 3.5,76.5 76.5,76.5

### Footprints (pad centres in the part's own frame; a part is rotated, then mirrored left to right if it is on the bottom)
CAPC2012X100N = smd 1.02 x 1.47: 1 -0.8,0; 2 0.8,0
CAP_0805 = smd 1.05 x 1.38: 1 -0.84,0; 2 0.84,0
SODFL4724X108N = smd 1.14 x 1.89: 1 -2.1,0; 2 2.1,0
SOIC127P600X175-8N = smd 1.525 x 0.7: 1 -2.712,1.905; 2 -2.712,0.635; 3 -2.712,-0.635; 4 -2.712,-1.905; 5 2.712,-1.905; 6 2.712,-0.635; 7 2.712,0.635; 8 2.712,1.905
QFP50P1600X1600X120-100N = smd 1.5 x 0.3: 1 -7.75,6; 2 -7.75,5.5; 3 -7.75,5; 4 -7.75,4.5; 5 -7.75,4; 6 -7.75,3.5; 7 -7.75,3; 8 -7.75,2.5; 9 -7.75,2; 10 -7.75,1.5; 11 -7.75,1; 12 -7.75,0.5; 13 -7.75,0; 14 -7.75,-0.5; 15 -7.75,-1; 16 -7.75,-1.5; 17 -7.75,-2; 18 -7.75,-2.5; 19 -7.75,-3; 20 -7.75,-3.5; 21 -7.75,-4; 22 -7.75,-4.5; 23 -7.75,-5; 24 -7.75,-5.5; 25 -7.75,-6; 51 7.75,-6; 52 7.75,-5.5; 53 7.75,-5; 54 7.75,-4.5; 55 7.75,-4; 56 7.75,-3.5; 57 7.75,-3; 58 7.75,-2.5; 59 7.75,-2; 60 7.75,-1.5; 61 7.75,-1; 62 7.75,-0.5; 63 7.75,0; 64 7.75,0.5; 65 7.75,1; 66 7.75,1.5; 67 7.75,2; 68 7.75,2.5; 69 7.75,3; 70 7.75,3.5; 71 7.75,4; 72 7.75,4.5; 73 7.75,5; 74 7.75,5.5; 75 7.75,6 | smd 0.3 x 1.5: 26 -6,-7.75; 27 -5.5,-7.75; 28 -5,-7.75; 29 -4.5,-7.75; 30 -4,-7.75; 31 -3.5,-7.75; 32 -3,-7.75; 33 -2.5,-7.75; 34 -2,-7.75; 35 -1.5,-7.75; 36 -1,-7.75; 37 -0.5,-7.75; 38 0,-7.75; 39 0.5,-7.75; 40 1,-7.75; 41 1.5,-7.75; 42 2,-7.75; 43 2.5,-7.75; 44 3,-7.75; 45 3.5,-7.75; 46 4,-7.75; 47 4.5,-7.75; 48 5,-7.75; 49 5.5,-7.75; 50 6,-7.75; 76 6,7.75; 77 5.5,7.75; 78 5,7.75; 79 4.5,7.75; 80 4,7.75; 81 3.5,7.75; 82 3,7.75; 83 2.5,7.75; 84 2,7.75; 85 1.5,7.75; 86 1,7.75; 87 0.5,7.75; 88 0,7.75; 89 -0.5,7.75; 90 -1,7.75; 91 -1.5,7.75; 92 -2,7.75; 93 -2.5,7.75; 94 -3,7.75; 95 -3.5,7.75; 96 -4,7.75; 97 -4.5,7.75; 98 -5,7.75; 99 -5.5,7.75; 100 -6,7.75
SOP50P490X110-10N = smd 1.4 x 0.3: 1 -2.2,1; 2 -2.2,0.5; 3 -2.2,0; 4 -2.2,-0.5; 5 -2.2,-1; 6 2.2,-1; 7 2.2,-0.5; 8 2.2,0; 9 2.2,0.5; 10 2.2,1
SOIC127P1420X360-21N = smd 2 x 0.7: 1 -6.6,5.715; 2 -6.6,4.445; 3 -6.6,3.175; 4 -6.6,1.905; 5 -6.6,0.635; 6 -6.6,-0.635; 7 -6.6,-1.905; 8 -6.6,-3.175; 9 -6.6,-4.445; 10 -6.6,-5.715; 11 6.6,-5.715; 12 6.6,-4.445; 13 6.6,-3.175; 14 6.6,-1.905; 15 6.6,-0.635; 16 6.6,0.635; 17 6.6,1.905; 18 6.6,3.175; 19 6.6,4.445; 20 6.6,5.715 | smd 6.2 x 9.8: 21 0,0
SOT95P280X145-5N = smd 1.372 x 0.559: 1 -1.143,0.94; 2 -1.143,0; 3 -1.143,-0.94; 4 1.143,-0.94; 5 1.143,0.94
SO16W = smd 0.6 x 2.2: 1 -4.445,-4.6; 2 -3.175,-4.6; 3 -1.905,-4.6; 4 -0.635,-4.6; 5 0.635,-4.6; 6 1.905,-4.6; 7 3.175,-4.6; 8 4.445,-4.6; 9 4.445,4.6; 10 3.175,4.6; 11 1.905,4.6; 12 0.635,4.6; 13 -0.635,4.6; 14 -1.905,4.6; 15 -3.175,4.6; 16 -4.445,4.6
AVRISP = drill 0.9 pad 1.626: 1 -1.27,2.54; 2 1.27,2.54; 3 -1.27,0; 4 1.27,0; 5 -1.27,-2.54; 6 1.27,-2.54
HDRV40W63P254_2X20_5080X500X88 = drill 1.1 pad 1.65 square: 1 -24.13,-1.27 | drill 1.1 pad 1.65: 2 -24.13,1.27; 3 -21.59,-1.27; 4 -21.59,1.27; 5 -19.05,-1.27; 6 -19.05,1.27; 7 -16.51,-1.27; 8 -16.51,1.27; 9 -13.97,-1.27; 10 -13.97,1.27; 11 -11.43,-1.27; 12 -11.43,1.27; 13 -8.89,-1.27; 14 -8.89,1.27; 15 -6.35,-1.27; 16 -6.35,1.27; 17 -3.81,-1.27; 18 -3.81,1.27; 19 -1.27,-1.27; 20 -1.27,1.27; 21 1.27,-1.27; 22 1.27,1.27; 23 3.81,-1.27; 24 3.81,1.27; 25 6.35,-1.27; 26 6.35,1.27; 27 8.89,-1.27; 28 8.89,1.27; 29 11.43,-1.27; 30 11.43,1.27; 31 13.97,-1.27; 32 13.97,1.27; 33 16.51,-1.27; 34 16.51,1.27; 35 19.05,-1.27; 36 19.05,1.27; 37 21.59,-1.27; 38 21.59,1.27; 39 24.13,-1.27; 40 24.13,1.27
1X03 = drill 1.016: 1 -2.54,0; 2 0,0; 3 2.54,0
HC49/S = drill 0.813: 1 -2.413,0; 2 2.413,0
0603 = smd 1.1 x 1: 1 -0.85,0; 2 0.85,0
DF13A-4P-1.25H = smd 1.6 x 2.2: M$0 -4.225,2.4; M$1 4.225,2.4 | smd 0.7 x 1.8: P$1 -1.875,-0.9; P$2 -0.625,-0.9; P$3 0.625,-0.9; P$4 1.875,-0.9
NEOPIXEL_12_FOOTPRINT = drill 1: 5V -4.457,-16.641; GND 12.207,-12.208; IN 4.459,16.638
CR1220_HOLDER = smd 3.5 x 3.5: + -8.2,0; +1 8.2,0 | smd 6 x 6: - 0,0
KMR621NGLFS = smd 0.8 x 1: 1 -2,0.8; 2 2,0.8; 3 -2,-0.8; 4 2,-0.8
70553-04 = drill 1.092 long: 1 -3.81,-7.62; 2 -1.27,-7.62; 3 1.27,-7.62; 4 3.81,-7.62

### Placement (x,y rotation side)
+5  64,48 270 top
C1  27.3,34.3 180 top
C2  63.4,34.2 180 top
C3  63.4,34.2 180 bottom
C4  49,73 0 bottom
C5  29.4,34.2 180 bottom
C6  47.9,56.5 135 top
C7  46,73 180 bottom
D1  11,22 0 top
D2  11,26 0 top
D3  35,26 180 top
D4  35,22 180 top
D5  11,19 180 top
D6  11,29 180 top
D7  35,29 0 top
D8  35,19 0 top
D9  45,22 0 top
D10  45,26 0 top
D11  69,26 180 top
D12  69,22 180 top
D13  45,19 180 top
D14  45,29 180 top
D15  69,29 0 top
D16  69,19 0 top
D17  35,22 0 bottom
D18  35,26 0 bottom
D19  11,26 180 bottom
D20  11,22 180 bottom
D21  35,19 180 bottom
D22  35,29 180 bottom
D23  11,29 0 bottom
D24  11,19 0 bottom
D25  69,22 0 bottom
D26  69,26 0 bottom
D27  45,26 180 bottom
D28  45,22 180 bottom
D29  69,19 180 bottom
D30  69,29 180 bottom
D31  45,29 0 bottom
D32  45,19 0 bottom
GND  20,72 180 top
IC1  40,50 225 top
IC2  67,48 90 top
IC3  23,25 180 bottom
IC4  11,35 0 top
IC5  69,35 0 top
IC6  57,25 180 bottom
IC7  57,25 180 top
IC8  23,25 180 top
IC9  23,57.5 90 bottom
ISP1  65.5,59 0 top
J1  76.5,48 270 top
JP1  32.75,75.75 90 top
JP2  35.75,75.75 90 top
JP3  38.75,75.75 90 top
Q1  20,65 180 top
Q3  47.65,76.32 180 top
R1  62,72 270 top
R2  70.3,69.7 180 top
R3  70.3,67.1 180 top
R8  26,65 0 top
R9  26,67 0 top
R10  26,71.9 0 top
R11  26,74 0 top
U$1  58,74 0 bottom
U$3  40,50 0 top
U$4  69,74 0 bottom
U$11  6.5,57 270 bottom
U$12  59.1,72 270 top
X1  6,68 90 top
X2  65.11,5.97 180 top
X3  31,6 180 top
X4  15,6 180 top
X5  49,6 180 top
X6  6,46 90 top

### Tracks (layer width: path | path; a pad name or v marks a point on that pad's centre or on a via)
+5  (via drill 0.35)
  Top 0.152: IC1.31 41.55,53.4 44.4,53.4 | 44.4,53.4 45.52,53.4 IC1.10 48.03,55.91 C6.1 | 35.4,46.7 35.29,46.7 IC1.61 30,41.41 30,38.9 U$3.5V | 35.4,46.7 37.64,46.7 IC1.80 43.94,40.4 47.2,40.4 51.2,44.4 51.2,45.87 49.59,47.49 | 49.59,47.49 IC1.98 | 49.59,47.49 50.09,47.49 50.3,47.7 50.3,48.19 IC1.100 48,50.48 v48,50.5 | v43.8,54.5 43.8,54 44.4,53.4 | 66.7,48.8 +5.1 63.46,48.26 | 66.7,48.8 67,49.1 IC2.8 | 66.7,48.8 67.5,48 IC2.4 67.5,38 66.5,37 66.5,35.3 66.8,35 IC5.2 | 35.4,46.7 32.3,49.8 30.6,49.8 15.8,35 IC4.2
  Top 0.254: v63.9,69.7 63.9,71.05 R1.1 | R2.2 69.45,70.05 v70.4,71 | v64,50.4 +5.1 | 63.46,48.26 50.22,48.26 IC1.100
  Top 0.508: R3.2 R2.2 v63.9,69.7
  Top 0.61: R3.2 69.45,64.22 ISP1.2
  Bottom 0.152: v48,50.5 46.4,52.1 45.9,52.1 43.8,54.2 v43.8,54.5
  Bottom 0.254: v70.4,71 70.88,71.47 U$4.P$1 | v64,50.4 64,53 65.5,54.5 65.5,60.27 ISP1.2
  Bottom 0.305: IC9.2 21.33,54.33 23.5,56.5 23.5,64 31,71.5 31,74.5 32.25,75.75 JP1.2
  Bottom 0.508: v63.9,69.7 58.3,69.7 | 58.3,69.7 44.7,69.7 42.8,71.6 42.8,73.2 40.25,75.75 JP3.2 JP2.2 JP1.2 | J1.4 J1.2 77.77,72.73 76.65,73.86 71.63,73.86 U$4.P$1 | U$1.P$1 59.88,71.28 58.3,69.7
+12  (via drill 0.35, 1)
  Top 0.61: v14.6,28.8 15.25,29.45 IC8.12 | IC8.6 30.73,25.64 31.4,26.3 v31.4,28.9 31.4,30.1 31.9,30.6 | IC7.12 49.64,29.45 v48.8,28.6 48.8,29.9 48.1,30.6 45.9,30.6 45.4,30.1 45.4,27 44.4,26 D27.1 | IC7.6 64.94,25.64 65.2,25.9 v65.2,28.9 65.2,30 65.9,30.7 65.9,33.1 64.8,34.2 C2.1 | 5,18.1 5,17.7 | 38.2,7 40,8.8 40,20.5 40.05,20.55 40,20.6 | 40,20.6 v41.4,22 D28.1 | 40,20.6 v38.6,22 D17.1 | D18.1 36.1,26 35,27.1 35,29.9 34.3,30.6 31.9,30.6 | 31.9,30.6 31.9,32.6 30.2,34.3 C1.1
  Top 1.016: D20.1 v7.45,20.55 5,18.1
  Top 1.27: X6.1 X6.2 5,36.11 5,17.7 5,12 10,7 38.2,7 74,7 76,9 76,19 v73,22 D25.1 D26.1 | D27.1 D28.1 | D18.1 D17.1 | D19.1 D20.1
  Bottom 0.61: IC3.6 15.06,25.64 14.6,26.1 v14.6,28.8 14.6,29.9 13.6,30.9 12.4,30.9 11.2,29.7 11.2,28.3 D19.1 | v31.4,28.9 30.86,29.45 IC3.12 28.45,29.45 28.1,29.8 28.1,33.7 C5.1 | IC6.6 49.17,25.64 48.8,26 v48.8,28.6 | 71.1,24.6 71.1,25.2 69.1,27.2 69.1,30.2 68.6,30.7 65.9,30.7 65.2,30 v65.2,28.9 64.66,29.45 IC6.12 62.45,29.45 62.1,29.8 62.1,33.7 C3.1 | v38.6,22 D17.1 | v41.4,22 D28.1
  Bottom 1.016: v7.45,20.55 D20.1
  Bottom 1.27: D20.1 D19.1 | D18.1 D17.1 | D27.1 D28.1 | D26.1 71.1,24.6 D25.1 v73,22
BOT
  pour Bottom (isolate 0.406): -15,86 -15,-10 90,-10 90,86
D23
  Top 0.152: IC1.77 45.42,36.8 55.13,36.8 56.7,36.8 61.9,31.6 61.9,30.1 62.56,29.45 IC7.9
D24
  Top 0.152: IC1.76 45.02,36.5 55,36.5 60.6,30.9 60.6,28.2 61.89,26.91 IC7.7
D25  (via drill 0.35)
  Top 0.152: IC1.75 38.2,39.72 38.2,39.5 41.59,36.1 54.03,36.1 56.2,33.93 v56.2,33.9
  Bottom 0.152: v56.2,33.9 58.1,33.9 61.4,30.6 61.4,29.2 62.42,28.18 IC6.13
D26  (via drill 0.35)
  Top 0.152: IC1.74 37.9,40.12 37.9,39.95 37.89,39.95 37.89,39.17 41.37,35.7 53.7,35.7 54.7,34.7 54.7,32.7 v56,31.4
  Bottom 0.152: v56,31.4 59.4,31.4 60.6,30.2 60.6,26.7 61.67,25.64 IC6.15
D27  (via drill 0.35)
  Top 0.152: IC1.73 37.57,40.5 37.5,40.5 37.5,38.94 41.44,35 v53.4,35
  Bottom 0.152: v53.4,35 53.9,34.5 53.9,31.6 53,30.7 53,28.5 51.41,26.91 IC6.7
D28  (via drill 0.35)
  Top 0.152: IC1.72 37.2,40.84 37.2,40.66 37.19,40.66 37.19,38.82 41.8,34.21 v52,34.21
  Bottom 0.152: v52,34.21 53,33.21 53,32.3 52,31.3 52,29.9 51.55,29.45 IC6.9
D29
  Top 0.152: IC1.71 36.8,41.14 36.8,38.58 41.78,33.6 52.5,33.6 53,33.1 53,27 51.64,25.64 IC7.15
D32
  Top 0.152: IC8.9 28.66,29.45 25.5,32.6 25.5,37.8 26.9,39.2 26.9,40.44 IC1.58
D33
  Top 0.152: IC1.57 24.5,38.74 24.5,32.1 26.6,30 26.6,28.5 28.19,26.91 IC8.7
D34  (via drill 0.35)
  Top 0.152: IC1.56 23.9,38.85 23.9,36 22.6,34.7 v22.5,34.7
  Bottom 0.152: IC3.15 28.47,25.64 26.6,27.5 26.6,30.6 v22.5,34.7
D35  (via drill 0.35)
  Top 0.152: IC1.55 23.2,38.86 v23.2,36.8
  Bottom 0.152: v23.2,36.8 23.2,35.5 27.4,31.3 27.4,29.4 28.62,28.18 IC3.13
D36  (via drill 0.35)
  Top 0.152: v20.3,34.6 20.3,35.7 21.1,36.5 21.1,37.46 IC1.54
  Bottom 0.152: IC3.7 17.91,26.91 19.2,28.2 19.2,33.5 v20.3,34.6
D37  (via drill 0.35)
  Top 0.152: IC1.53 20.21,37.28 v20.21,36.94
  Bottom 0.152: v20.21,36.94 18,34.73 18,29.9 17.55,29.45 IC3.9
D39
  Top 0.152: IC1.70 36.4,41.45 36.4,38.34 41.55,33.2 50.8,33.2 52,32 52,29.1 51.08,28.18 IC7.13
D40
  Top 0.152: IC1.52 19.6,37.38 19.6,27.3 17.94,25.64 IC8.15
D41
  Top 0.152: IC8.13 17.88,28.18 18.3,28.6 18.3,36.78 IC1.51
DRAIN1
  Top 0.305: X1.1 17.11,64.19 Q1.7 Q1.8
DRAIN2
  Top 0.305: Q1.6 Q1.5 13.8,66.91 X1.2
DRAIN3
  Top 0.305: X1.3 16.46,69.27 GND.8 GND.7
DRAIN4
  Top 0.305: X1.4 14.44,72.64 GND.6 GND.5
GATE1
  Top 0.152: IC1.41 25.15,62.73 R8.1 24.52,64.36 Q1.2
GND  (via drill 0.35, 1)
  Top 0.152: v28.2,72 28.1,71.9 R10.2 | Q1.3 22.88,65.8 26.05,65.8 R8.2 26.85,61.89 v29.37,59.37 | IC1.32 37.17,57.07 | 37.17,57.07 41.34,52.91 41.39,52.91 | 41.39,52.91 v46.1,52.91 | v44.8,54.1 45.51,54.1 IC1.11 47.31,55.89 C6.2 | IC1.62 35.39,46.09 v37.1,46.09 | v37.1,47.31 37.74,47.31 IC1.81 | IC1.81 43.65,41.4 v47,41.4 | IC1.81 42.49,42.56 42.49,42.92 42.5,42.92 42.5,43.4 v48.05,48.95 48.1,49 48.78,49 IC1.99 | v42.1,52.2 41.39,52.91 | v34.4,53.1 37.17,55.87 37.17,57.07 | v70.5,30.8 71.5,31.8 71.5,34.8 70.36,35.94 IC5.5 | IC4.5 12.18,35.9 v13.5,35.9
  Top 0.254: U$12.3 56.8,75.5 v56.12,75.5 | v67.12,76.78 71.72,76.78 74.7,73.8 76.4,73.8 76.6,73.6 76.6,67.5 77.05,67.05 J1.6 | IC2.3 67,46.8 v66.6,47.2 +5.2 v52.4,47.2 | 21.91,63.09 Q1.1
  Top 0.305: v28.2,74 R11.2 31.14,78.29 JP1.3 JP2.3 JP3.3 | R10.2 26.85,72.05 26.1,72.8 22.88,72.8 | 22.88,72.8 GND.3 | GND.1 21.81,70.09 21.4,70.5 21.4,71.8 22.4,72.8 22.88,72.8 | 21.6,63.4 21.91,63.09 | 21.6,63.4 21.6,65.1 22.14,65.64 Q1.3 | 21.6,63.4 20.7,64.3 v20.7,64.8 20.7,67 21.7,68 26.2,68 26.85,67.35 R9.2 | v24.5,62 23.81,62 Q1.1 21.62,62 v20.5,62
  Top 0.61: D23.2 8.9,29.9 | v64.78,31.9 IC6.11 62.6,31.71 C2.2 59.01,37.79 U$3.GND | v70.5,30.8 71.1,30.2 D30.2 | IC3.11 v29.6,32.1 27.5,32.1 26.5,33.1 C1.2 | v50.4,32.1 IC6.10
  Top 1.016: 8.9,29.9 11,32 15.11,32 IC3.10 | v6.7,28.3 8.2,28.3 D23.2 | v38.7,19 D21.2 | v41.3,19 D32.2 | v38.8,29 D22.2 | v41.2,29 D31.2 | D24.2 8.9,18 v7.9,17
  Top 1.27: X6.3 X6.4 10.81,49.81 2,41 v2,28.3 v2,12 | v74,17 72,19 D29.2 | IC6.19 IC6.20 62.31,18 59,18 v57,16 55,18 51.69,18 IC6.1 IC6.2 | IC3.19 IC3.20 28.31,18 25,18 v23,16 21,18 17.69,18 IC3.1 IC3.2
  Bottom 0.152: C7.2 C4.2 | v46.1,52.91 44.91,54.1 v44.8,54.1 | v37.1,46.09 v37.1,47.31 | v47,41.4 48.6,41.4 U$3.GND | v48.05,48.95 46.39,50.61 43.69,50.61 v42.1,52.2 | v29.37,59.37 29.37,58.13 v34.4,53.1 | v13.5,35.9 15.11,34.28 15.11,32
  Bottom 0.254: v48.05,48.95 49.8,47.2 v52.4,47.2 | v66.6,47.2 65,48.8 65,52.8 66.77,54.57 ISP1.6
  Bottom 0.305: v28.2,74 v28.2,72 21,64.8 v20.7,64.8 18.4,62.5 IC9.8 | C4.2 48.2,76.5 46.7,78 | 46.7,78 55.1,78 | U$1.P$4 v56.12,75.5 56.12,76.97 55.1,78 | 55.1,78 65.9,78 v67.12,76.78 U$4.P$4 | U$11.- 1.17,51.67 1.17,47.83 3,46 9,46 10.27,47.27 X6.3 | IC9.5 IC9.6 IC9.7 IC9.8 | IC9.13 IC9.12 IC9.11 IC9.10 IC9.9 27.55,62 v24.5,62 | v20.5,62 18.45,62 IC9.8 | JP3.3 46.41,78.29 46.7,78
  Bottom 0.61: 8.9,29.9 D23.2 8.2,28.3 v6.7,28.3 | J1.39 74.33,23.87 72.8,25.4 72.8,27.3 D30.2 71.1,30.2 v70.5,30.8 69.4,31.9 v64.78,31.9 | v64.78,31.9 IC6.11 | D32.2 v41.3,19 | v38.7,19 D21.2 38.1,19 40,20.9 40,27.8 v38.8,29 D22.2 35.39,30.71 31.1,30.71 | v41.2,29 D31.2 44.61,30.71 48.9,30.71 | 48.9,30.71 IC6.10 | 31.1,30.71 IC3.11 | 31.1,30.71 29.72,32.1 v29.6,32.1 30.2,32.7 C5.2 | 48.9,30.71 50.28,32.1 v50.4,32.1 | C3.2 64.2,32.48 v64.78,31.9
  Bottom 1.016: 8.9,29.9 11,32 15.11,32 IC3.10 | v2,28.3 v6.7,28.3 | 39,5 42.9,8.9 D32.2 | v41.3,19 v38.7,19 | v41.2,29 v38.8,29 | v2,12 2.9,12 v7.9,17 8.9,18 D24.2
  Bottom 1.27: v2,12 9,5 23,5 | 23,5 39,5 57,5 | 57,5 71,5 74,8 v74,17 | v74,17 72,19 D29.2 | 23,5 v23,16 | v23,16 25,18 28.31,18 IC3.20 IC3.19 | v23,16 21,18 17.69,18 IC3.1 IC3.2 | 57,5 v57,16 | v57,16 59,18 62.31,18 IC6.20 IC6.19 | v57,16 55,18 51.69,18 IC6.1 IC6.2 | v74,17 75.23,18.23 J1.39
MISO
  Top 0.152: ISP1.1 45.18,61.54 IC1.22
MOSI
  Top 0.152: ISP1.4 65.47,60.3 44.64,60.3 IC1.21
N$1
  Top 0.152: IC1.33 36.26,57.25 35.68,57.83 35.68,61.93 Q3.1
  Bottom 0.152: Q3.1 50.06,73.26 C4.1
N$2
  Top 0.152: IC1.34 35.91,56.89 35.22,57.58 35.22,63.02 C7.1 45.2,76.28 Q3.2
  Bottom 0.152: Q3.2 45.24,73.04 C7.1
OUT_1
  Top 0.61: D12.2 65.81,23.09 IC7.4 | D16.1 65.5,19 61.1,14.6 61.3,14.4 X2.4
  Top 1.27: D12.2 D16.1
OUT_2
  Top 0.61: IC7.5 65.27,24.36 D11.2 69,23.9 69,17.4 68,16.4 65.7,16.4 63.84,14.54 X2.3
  Top 1.27: D15.1 D11.2
OUT_3
  Top 0.61: IC7.16 48.73,24.36 D10.2 45.2,24.1 45.2,17.4 46.2,16.4 48.7,16.4 50.27,14.83 X5.2
  Top 1.27: D10.2 D14.1
OUT_4
  Top 0.61: IC7.17 48.19,23.09 D9.2 | D13.1 48.5,19 52.81,14.69 X5.1
  Top 1.27: D13.1 D9.2
OUT_5
  Top 0.61: IC8.4 31.81,23.09 D4.2 | D8.1 31.4,19 27.2,14.8 X3.4
  Top 1.27: D4.2 D8.1
OUT_6
  Top 0.61: IC8.5 31.27,24.36 D3.2 34.8,24.1 34.8,17.1 34.1,16.4 31.1,16.4 29.73,15.03 X3.3
  Top 1.27: D7.1 D3.2
OUT_7
  Top 0.61: X4.2 16.27,15.03 14.9,16.4 12.2,16.4 11.2,17.4 11.2,24.1 D2.2 14.73,24.36 IC8.16
  Top 1.27: D6.1 D2.2
OUT_8
  Top 0.61: D5.1 14.6,19 18.81,14.79 X4.1 | IC8.17 14.19,23.09 D1.2
  Top 1.27: D1.2 D5.1
OUT_9
  Bottom 0.61: IC3.4 14.19,23.09 D20.2 | D24.1 13.73,18.37 X4.3
  Bottom 1.27: D24.1 D20.2
OUT_10
  Bottom 0.61: IC3.5 14.73,24.36 D19.2 11.19,24.09 X4.4
  Bottom 1.27: D19.2 D23.1
OUT_11
  Bottom 0.61: IC3.17 31.81,23.09 D17.2 | X3.2 32.9,14.25 D21.1
  Bottom 1.27: D21.1 D17.2
OUT_12
  Bottom 0.61: IC3.16 31.27,24.36 32.8,25.9 | 32.8,25.9 D18.2 | X3.1 34.81,23.89 32.8,25.9
  Bottom 1.27: D18.2 D22.1
OUT_13
  Bottom 0.61: D32.1 47.73,18.37 X5.3 | IC6.4 48.19,23.09 D28.2
  Bottom 1.27: D32.1 D28.2
OUT_14
  Bottom 0.61: X5.4 45.19,24.09 D27.2 48.73,24.36 IC6.5
  Bottom 1.27: D27.2 D31.1
OUT_15
  Bottom 0.61: IC6.17 65.81,23.09 D25.2 | X2.2 66.38,18.48 D29.1
  Bottom 1.27: D29.1 D25.2
OUT_16
  Bottom 0.61: IC6.16 65.27,24.36 D26.2 68.92,23.98 X2.1
  Bottom 1.27: D26.2 D30.1
PI_RX
  Top 0.152: J1.10 76.5,60.7 76.5,56.3 75.8,55.6 72.3,55.6 71.8,55.1 52.17,55.1 IC1.3
PI_TX  (via drill 0.35)
  Top 0.152: IC1.2 52.37,54.59 72.2,54.59 v72.9,53.89
  Bottom 0.152: J1.8 77.77,64.47 76.5,63.2 74.8,63.2 72.9,61.3 v72.9,53.89
PWM2  (via drill 0.35)
  Top 0.152: v46,51.3 46.25,51.3 IC1.6
  Bottom 0.152: IC3.8 17.88,28.18 18.5,28.8 18.5,33.9 40,55.4 41.9,55.4 v46,51.3
PWM3  (via drill 0.35)
  Top 0.152: IC1.7 46.54,52.3 45.96,52.3 44.83,51.17 v36.73,51.17
  Bottom 0.152: v36.73,51.17 36.53,51.17 22.3,36.94 22.3,35.8 27,31.1 27,28.6 28.69,26.91 IC3.14
PWM4  (via drill 0.35)
  Top 0.152: v51.3,49.9 51.3,51.1 50.56,51.84 50.32,51.84 IC1.1
  Bottom 0.152: IC6.14 62.19,26.91 61,28.1 61,30.4 58.9,32.5 56.3,32.5 54.3,34.5 54.3,46.9 v51.3,49.9
PWM5  (via drill 0.35)
  Top 0.152: v45.7,50 48.31,52.61 IC1.5
  Bottom 0.152: IC6.8 51.28,28.18 52.4,29.3 52.4,31 53.4,32 53.4,33.8 42.3,44.9 42.3,46.6 v45.7,50
PWM6  (via drill 0.35)
  Top 0.152: IC7.8 62.22,28.18 61.1,29.3 61.1,31.4 v57.1,35.4 | v45.8,57 45.59,57 IC1.15
  Bottom 0.152: v57.1,35.4 55.7,36.8 55.7,47.1 v45.8,57
PWM7  (via drill 0.35)
  Top 0.152: IC7.14 51.2,26.91 52.31,28 52.31,32.13 52.3,32.13 v52.3,32.8 | v42.23,54.07 42.23,54.1 43.86,55.73 43.86,55.98 IC1.16
  Bottom 0.152: v52.3,32.8 38.4,46.7 38.4,50.9 41.57,54.07 v42.23,54.07
PWM8  (via drill 0.35)
  Top 0.152: IC8.8 28.03,28.18 27,29.2 27,30.2 25,32.2 25,38.3 v26.1,39.4 | v41.5,54.7 42.2,54.7 43.55,56.05 43.55,56.21 44.07,56.72 IC1.17
  Bottom 0.152: v41.5,54.7 26.2,39.4 v26.1,39.4
PWM9  (via drill 0.35)
  Top 0.152: IC8.14 17.91,26.91 18.91,27.91 v18.91,36.5 | v42.6,56.1 43.71,57.21 IC1.18
  Bottom 0.152: v42.6,56.1 40.1,56.1 22,38 20.41,38 v18.91,36.5
PWM10  (via drill 0.35)
  Top 0.152: IC1.23 44,61.07 v44,64
  Bottom 0.152: v44,64 38.75,69.25 JP3.1
PWM11  (via drill 0.35)
  Top 0.152: IC1.24 43,60.78 v43,63
  Bottom 0.152: v43,63 35.75,70.25 JP2.1
PWM12  (via drill 0.35)
  Top 0.152: IC1.25 42,60.48 v42,62
  Bottom 0.152: v42,62 32.75,71.25 JP1.1
PWM13
  Top 0.152: IC1.26 37.76,60.72 37.76,61.62 42.78,66.64 U$3.IN
PWM44
  Top 0.152: Q1.4 22.81,67 R9.1 25.15,66.65 25.6,66.2 27.5,66.2 28,65.7 28,62.8 30.1,60.7 30.1,58.49 IC1.40
PWM45
  Top 0.152: R10.1 25.4,71.9 28.4,68.9 28.4,62.93 30.5,60.83 30.5,58.79 IC1.39
  Top 0.305: GND.2 24.61,71.36 R10.1
PWM46
  Top 0.152: R11.1 25.15,73.95 25.9,73.2 28,73.2 28.9,72.3 28.9,62.96 30.91,60.95 30.91,59.09 IC1.38
  Top 0.305: GND.4 25.11,73.91 25.15,73.95
RESET  (via drill 0.35)
  Top 0.152: v58.8,68.7 59.9,69.8 U$12.2 61.05,71.15 R1.2
  Top 0.254: v39.6,58.7 38.6,57.7 37.96,57.7 IC1.30
  Bottom 0.254: v39.6,58.7 40.6,58.7 41.95,60.05 50.6,68.7 v58.8,68.7 58.8,61.89 ISP1.5
SCK
  Top 0.152: ISP1.3 44.05,59 IC1.20
SCL  (via drill 0.35)
  Top 0.152: R3.1 71.15,68.15 v71,68.3 | IC2.10 v66,52.7 54.2,52.7 v54,52.5
  Top 0.508: J1.5 71.2,67.05 R3.1
  Bottom 0.152: v71,68.3 71,57.7 v66,52.7 | v54,52.5 52,52.5 46.5,58 41,58 34.5,51.5 32.5,51.5 31,53 27.66,53 IC9.16
  Bottom 0.254: v71,68.3 69.62,69.67 | 69.62,69.67 U$4.P$2 | 69.62,69.67 67.42,69.67 62.71,74.39 59.09,74.39 58.62,73.92 U$1.P$2
SDA  (via drill 0.35)
  Top 0.152: R2.1 72,68.85 v72,68.3 | IC2.9 66.5,52.2 v67.7,53.4 53.1,53.4 v53,53.5
  Top 0.254: v71.1,74.8 71.1,69.75 71.26,69.59
  Top 0.508: J1.3 71.26,69.59 R2.1
  Bottom 0.152: 68.4,73.08 U$4.P$3 | v72,68.3 72,57.7 v67.7,53.4 | v53,53.5 47,59.5 42,59.5 34.5,52 33,52 30.67,54.33 IC9.15
  Bottom 0.254: U$1.P$3 57.38,74.17 58,74.8 64.6,74.8 66,73.4 66,71.8 66.8,71 68.2,71 68.4,71.2 68.4,73.08 | U$4.P$3 68.38,74.17 69,74.8 v71.1,74.8
T1  (via drill 0.35)
  Top 0.152: IC4.1 10.72,36.8 17,36.8 30.4,50.2 44.3,50.2 v45.9,48.6 | v53,46 v65,46 | v67.6,48.8 67.5,48.9 IC2.7
  Bottom 0.152: v45.9,48.6 48.5,46 v53,46 | v65,46 67.1,46 67.8,46.7 67.8,48.6 v67.6,48.8
T2
  Top 0.152: IC5.1 68,36.08 IC2.5
TOP
  pour Top (isolate 0.406): -10,85 -10,-5 85,-5 85,85
VBAT
  Bottom 0.305: U$11.+ 14.5,57.2 14.5,53 | IC9.14 24.59,55.59 20.5,51.5 16,51.5 14.5,53 | U$11.+1 10.7,53 14.5,53

### Text on the board
tPlace: ScubaSteve-1.0 | Jackson Sugar | S1 | S2 | S3 | ISP
tNames: RESET | F1 | Power | }GND | }5-50V | B1 | B2 | B3 | B4 | B5 | B6 | B7 | B8
200bmp: C:/Users/jack/Documents/Melissa/Minion/Bitmap/URI_1.bmp